# EAGLE design estimator_board (EAGLE 7.5.0)
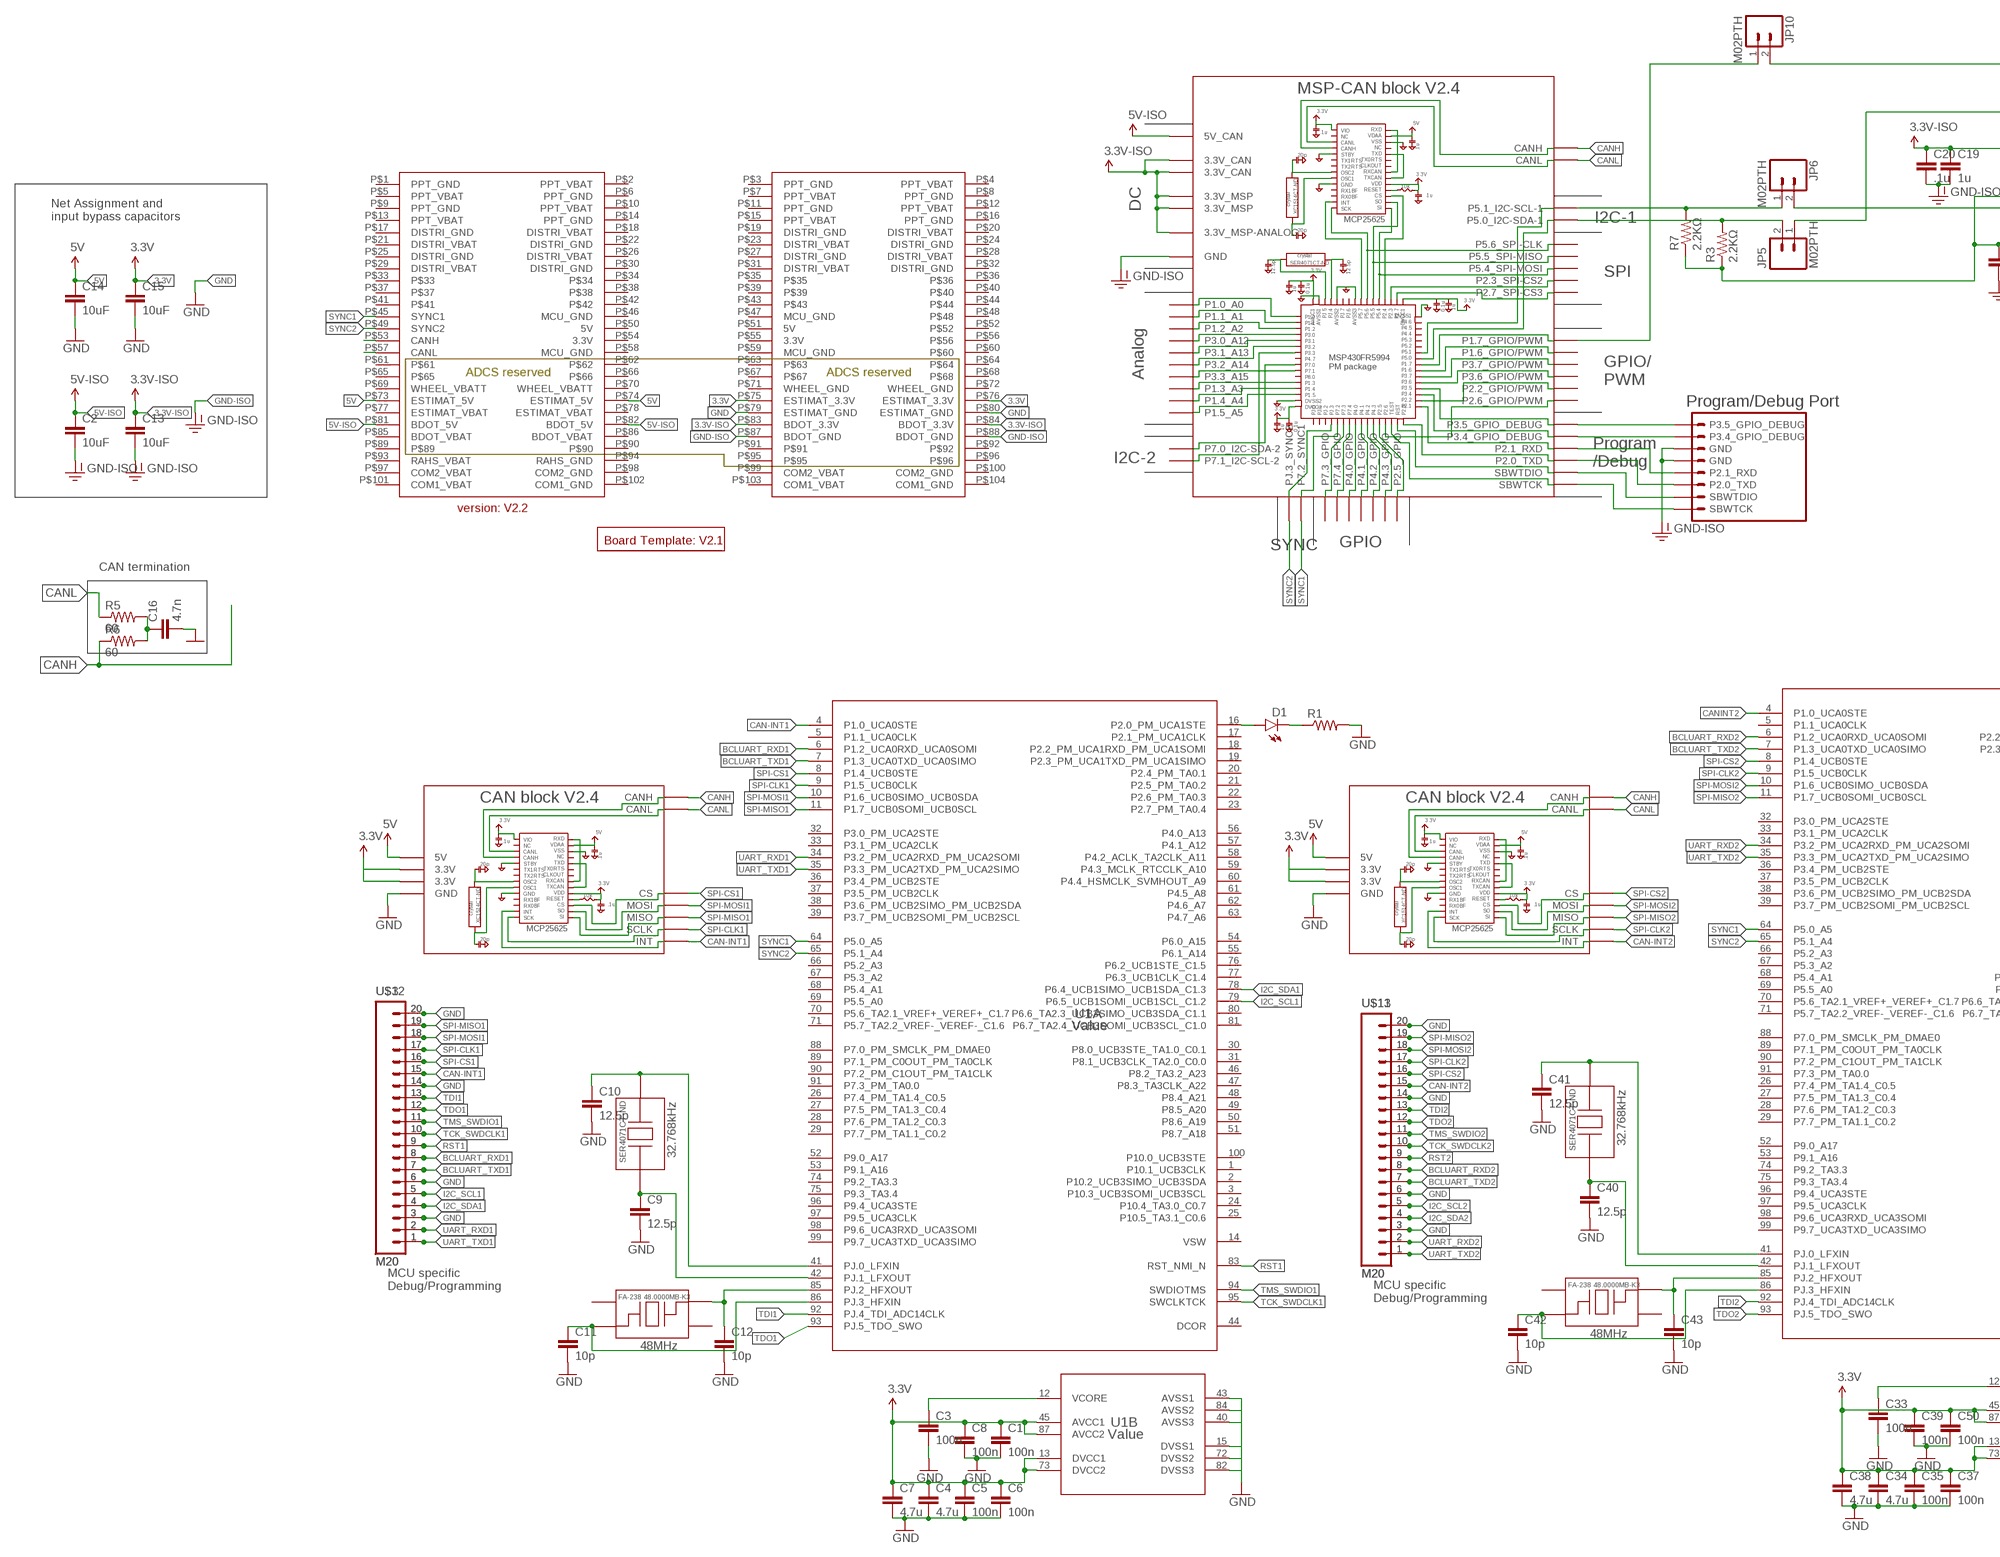
[diagram p0: schematic, sheet 1, part 1 of 2]
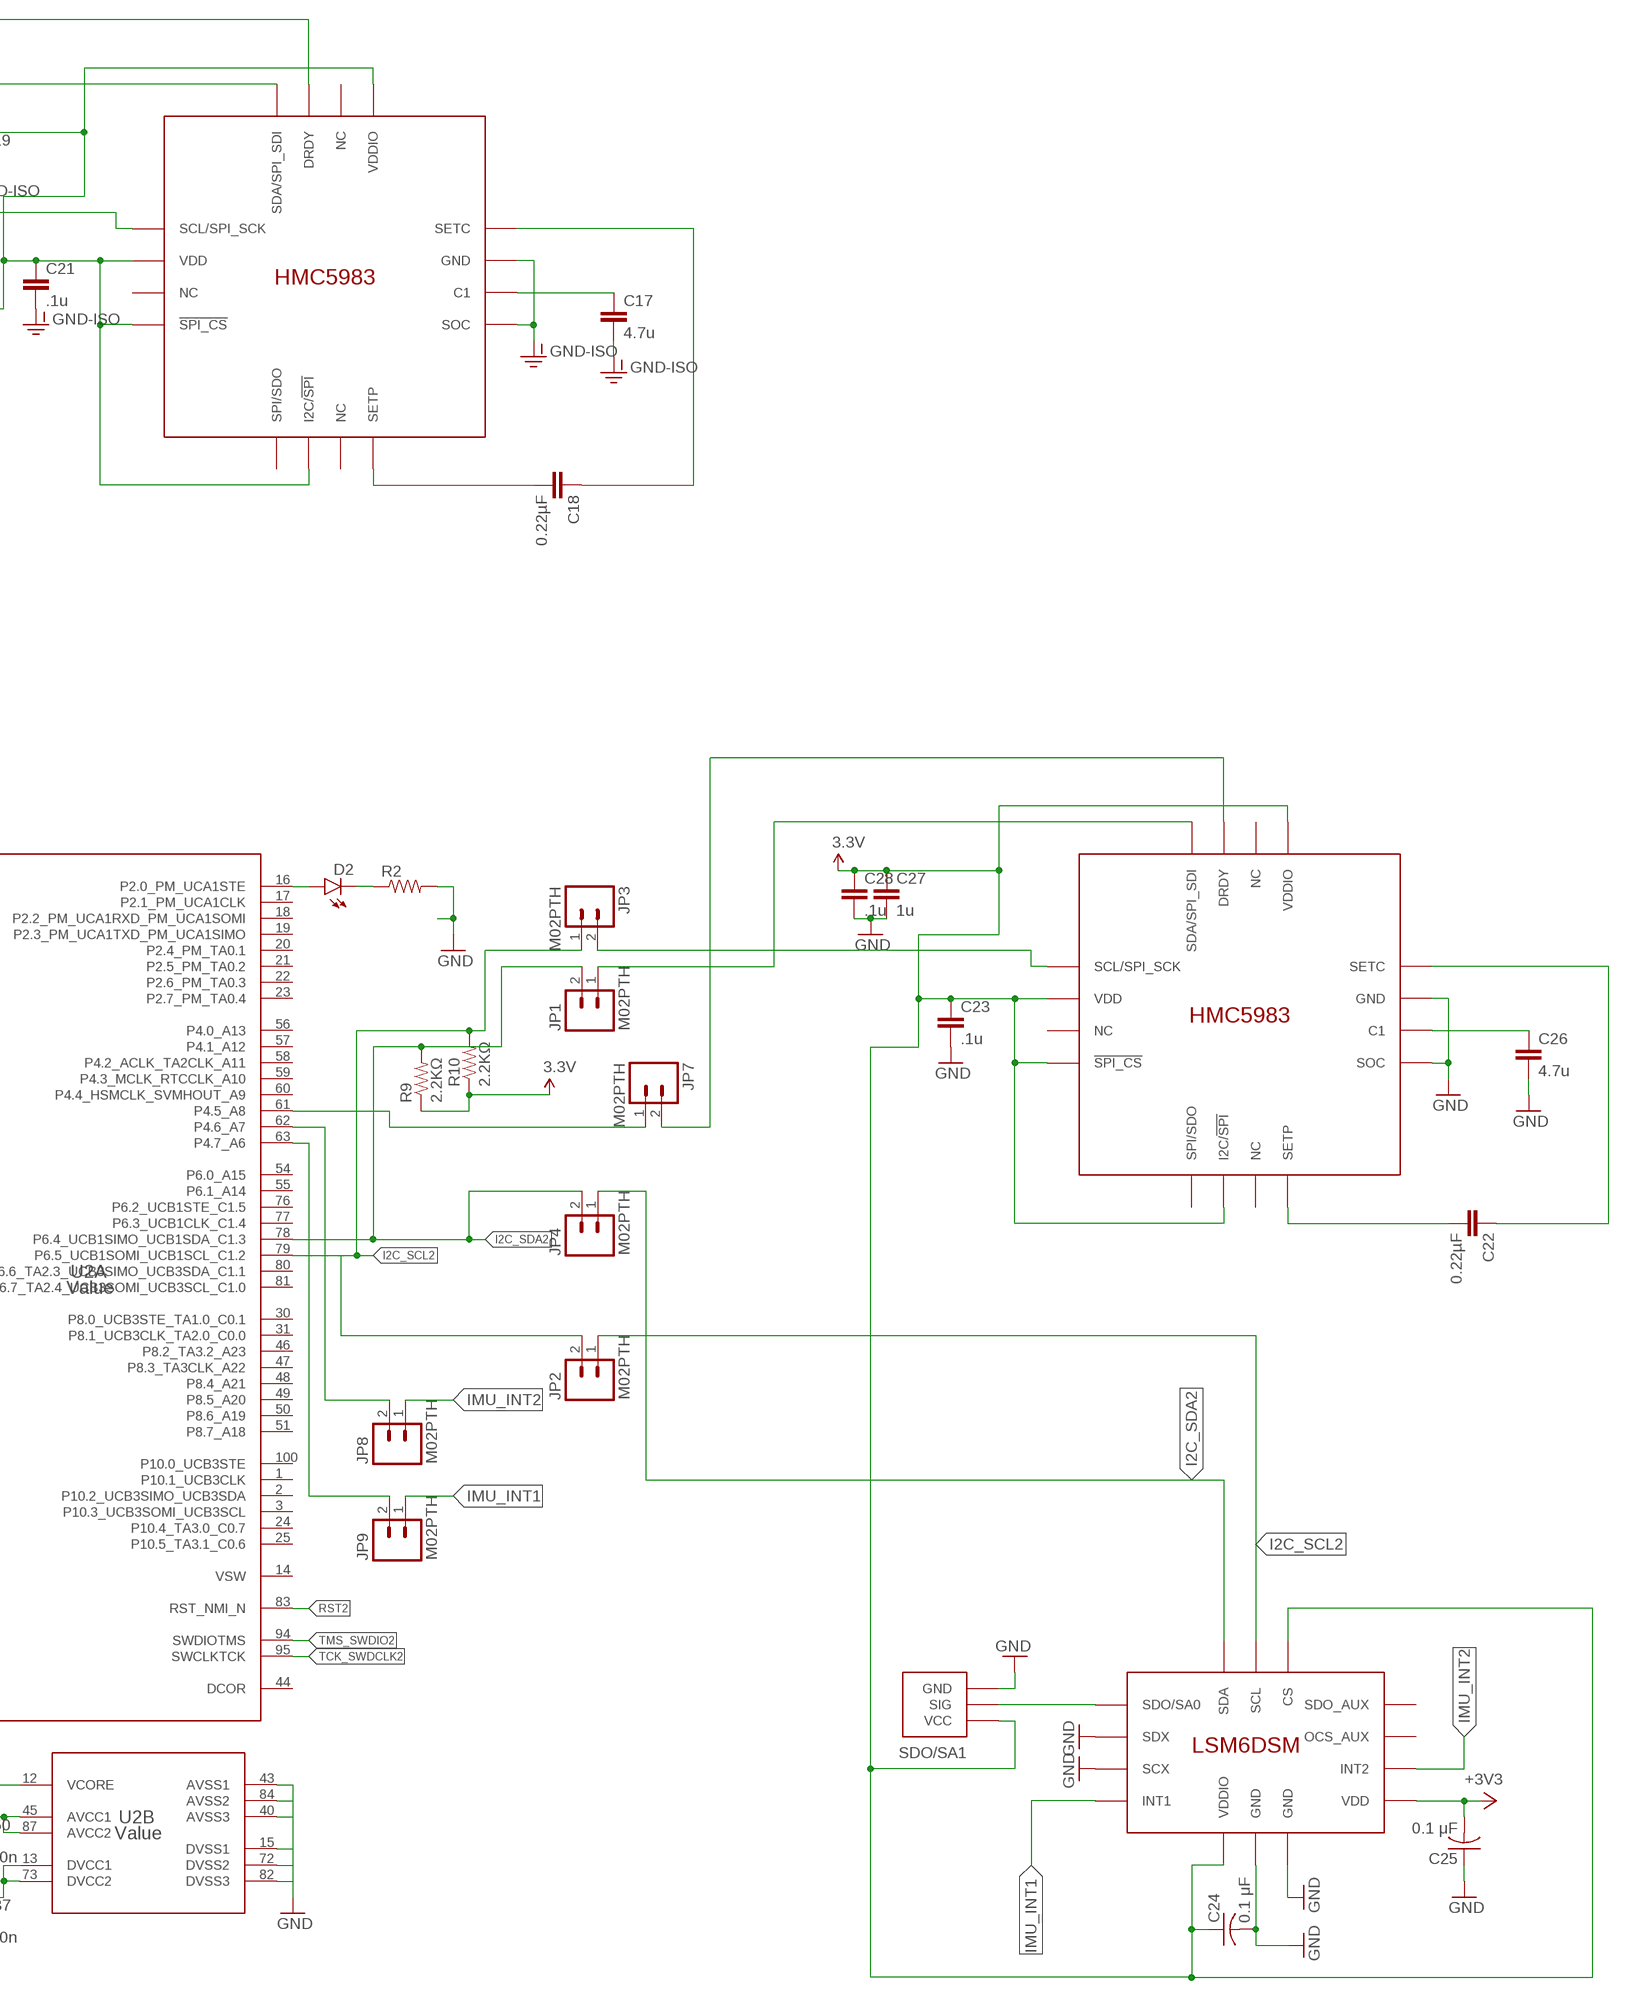
[diagram p1: schematic, sheet 1, part 2 of 2]

## Parts
C1  100n  CAPACITOR0805  [0805]
C2  10uF  CAPACITOR0805  [0805]
C3  100n  CAPACITOR0805  [0805]
C4  4.7u  CAPACITOR0805  [0805]
C5  100n  CAPACITOR0805  [0805]
C6  100n  CAPACITOR0805  [0805]
C7  4.7u  CAPACITOR0805  [0805]
C8  100n  CAPACITOR0805  [0805]
C9  12.5p  CAPACITOR0805  [0805]
C10  12.5p  CAPACITOR0805  [0805]
C11  10p  CAPACITOR0805  [0805]
C12  10p  CAPACITOR0805  [0805]
C13  10uF  CAPACITOR0805  [0805]
C14  10uF  CAPACITOR0805  [0805]
C15  10uF  CAPACITOR0805  [0805]
C16  4.7n  CAP0805  [0805]
C17  4.7u  CAPACITOR0805  [0805]
C18  0.22µF  CAPACITOR0805  [0805]
C19  1u  CAPACITOR0805  [0805]
C20  .1u  CAPACITOR0805  [0805]
C21  .1u  CAPACITOR0805  [0805]
C22  0.22µF  CAPACITOR0805  [0805]
C23  .1u  CAPACITOR0805  [0805]
C24  0.1 μF  C-USC0805  [C0805]
C25  0.1 μF  C-USC0805  [C0805]
C26  4.7u  CAPACITOR0805  [0805]
C27  1u  CAPACITOR0805  [0805]
C28  .1u  CAPACITOR0805  [0805]
C33  100n  CAPACITOR0805  [0805]
C34  4.7u  CAPACITOR0805  [0805]
C35  100n  CAPACITOR0805  [0805]
C37  100n  CAPACITOR0805  [0805]
C38  4.7u  CAPACITOR0805  [0805]
C39  100n  CAPACITOR0805  [0805]
C40  12.5p  CAPACITOR0805  [0805]
C41  12.5p  CAPACITOR0805  [0805]
C42  10p  CAPACITOR0805  [0805]
C43  10p  CAPACITOR0805  [0805]
C50  100n  CAPACITOR0805  [0805]
D1  LED  [LED-1206]
D2  LED  [LED-1206]
JP1  M02PTH  [1X02]
JP2  M02PTH  [1X02]
JP3  M02PTH  [1X02]
JP4  M02PTH  [1X02]
JP5  M02PTH  [1X02]
JP6  M02PTH  [1X02]
JP7  M02PTH  [1X02]
JP8  M02PTH  [1X02]
JP9  M02PTH  [1X02]
JP10  M02PTH  [1X02]
R1  RESISTOR0805  [0805]
R2  RESISTOR0805  [0805]
R3  2.2KΩ  RESISTOR0805  [0805]
R5  60  RESISTOR0805-RES  [0805]
R6  60  RESISTOR0805-RES  [0805]
R7  2.2KΩ  RESISTOR0805  [0805]
R9  2.2KΩ  RESISTOR0805  [0805]
R10  2.2KΩ  RESISTOR0805  [0805]
SDO/SA1  0_OHM_JUMPER  [0_OHM_JUMPER]
U1  Value  MSP432P401R_PZ  [PZ0100A_N]
U2  Value  MSP432P401R_PZ  [PZ0100A_N]
U$1  EPSON_CRYSTAL_FC-135R  [FC-135R]
U$2  EPSON_CRYSTAL_FA-238  [FA-238]
U$3  M20  [1X20]
U$4  EPSON_CRYSTAL_FC-135R  [FC-135R]
U$5  BOARD_TEMPLATE  [BOARD_TEMPLATE]
U$6  PC104_CONNECTOR  [PC104_CONNECTOR]
U$7  MSP-CAN_BLOCK  [MSP-CAN_BLOCK]
U$8  CAN_BLOCK  [CAN_BLOCK]
U$9  EPSON_CRYSTAL_FA-238  [FA-238]
U$10  CAN_BLOCK  [CAN_BLOCK]
U$11  M20  [1X20]
U$12  M20  [1X20]
U$13  M20  [1X20]
U$14  PROGRAM/DEBUG_PORT  [1X08_CONNECTOR]
U$15  HMC5983  [HMC5983]
U$17  LSM6DSM  [LSM6DSM]
U$18  HMC5983  [HMC5983]

## Nets
3.3V: C1.1 C4.1 C5.1 C6.1 C7.1 C8.1 C15.1 C23.1 C24.1 C25.2 C27.1 C28.1 C34.1 C35.1 C37.1 C38.1 C39.1 C50.1 R9.1 R10.1 SDO/SA1.P$3(VCC) U1.13(B:DVCC1) U1.45(B:AVCC1) U1.73(B:DVCC2) U1.87(B:AVCC2) U2.13(B:DVCC1) U2.45(B:AVCC1) U2.73(B:DVCC2) U2.87(B:AVCC2) U$6.P$75(ESTIMAT_3.3V) U$6.P$76(ESTIMAT_3.3V) U$8.3.3V@CAN1(3.3V) U$8.3.3V@CAN2(3.3V) U$10.3.3V@CAN1(3.3V) U$10.3.3V@CAN2(3.3V) U$17.CS U$17.VDD U$17.VDDIO U$18.!SPI_CS U$18.I2C/!SPI U$18.VDD U$18.VDDIO ; supply symbol labelled +3V3
3.3V-ISO: C13.1 C19.1 C20.1 C21.1 R3.1 R7.1 U$6.P$83(BDOT_3.3V) U$6.P$84(BDOT_3.3V) U$7.3.3V@CAN1(3.3V_CAN) U$7.3.3V@CAN2(3.3V_CAN) U$7.3.3V@MSP1(3.3V_MSP) U$7.3.3V@MSP2(3.3V_MSP) U$7.3.3V_ANALOG@MSP2(3.3V_MSP-ANALOG) U$15.!SPI_CS U$15.I2C/!SPI U$15.VDD U$15.VDDIO ; supply symbol labelled VCC
5V: C14.1 U$6.P$73(ESTIMAT_5V) U$6.P$74(ESTIMAT_5V) U$8.5V U$10.5V
5V-ISO: C2.1 U$6.P$81(BDOT_5V) U$6.P$82(BDOT_5V) U$7.5V(5V_CAN) ; supply symbol labelled VDD
BCLUART_RXD1: U1.6(A:P1.2_UCA0RXD_UCA0SOMI) U$3.8 U$12.8
BCLUART_RXD2: U2.6(A:P1.2_UCA0RXD_UCA0SOMI) U$11.8 U$13.8
BCLUART_TXD1: U1.7(A:P1.3_UCA0TXD_UCA0SIMO) U$3.7 U$12.7
BCLUART_TXD2: U2.7(A:P1.3_UCA0TXD_UCA0SIMO) U$11.7 U$13.7
CAN-INT1: U1.4(A:P1.0_UCA0STE) U$3.15 U$8.INT U$12.15
CAN-INT2: U$10.INT U$11.15 U$13.15
CANH: R6.1 U$6.P$53(CANH) U$7.CANH U$8.CANH U$10.CANH
CANINT2: U2.4(A:P1.0_UCA0STE)
CANL: R5.1 U$6.P$57(CANL) U$7.CANL U$8.CANL U$10.CANL
GND: C1.2 C3.2 C4.2 C5.2 C6.2 C7.2 C8.2 C9.2 C10.2 C11.2 C12.2 C14.2 C15.2 C16.2 C23.2 C24.2 C25.1 C26.2 C27.2 C28.2 C33.2 C34.2 C35.2 C37.2 C38.2 C39.2 C40.2 C41.2 C42.2 C43.2 C50.2 R1.2 R2.2 SDO/SA1.P$1(GND) U1.15(B:DVSS1) U1.40(B:AVSS3) U1.43(B:AVSS1) U1.72(B:DVSS2) U1.82(B:DVSS3) U1.84(B:AVSS2) U2.15(B:DVSS1) U2.40(B:AVSS3) U2.43(B:AVSS1) U2.72(B:DVSS2) U2.82(B:DVSS3) U2.84(B:AVSS2) U$3.3 U$3.6 U$3.14 U$3.20 U$6.P$79(ESTIMAT_GND) U$6.P$80(ESTIMAT_GND) U$8.GND@1(GND) U$8.GND@2(GND) U$8.GND@3(GND) U$8.GND@4(GND) U$8.GND@5(GND) U$8.GND@11(GND) U$8.GND@12(GND) U$8.GND@13(GND) U$10.GND@1(GND) U$10.GND@2(GND) U$10.GND@3(GND) U$10.GND@4(GND) U$10.GND@5(GND) U$10.GND@11(GND) U$10.GND@12(GND) U$10.GND@13(GND) U$11.3 U$11.6 U$11.14 U$11.20 U$12.3 U$12.6 U$12.14 U$12.20 U$13.3 U$13.6 U$13.14 U$13.20 U$17.GND@1(GND) U$17.GND@2(GND) U$17.SCX U$17.SDX U$18.GND U$18.SOC
GND-ISO: C2.2 C13.2 C17.2 C19.2 C20.2 C21.2 U$6.P$87(BDOT_GND) U$6.P$88(BDOT_GND) U$7.GND@1(GND) U$7.GND@2(GND) U$7.GND@3(GND) U$7.GND@4(GND) U$7.GND@5(GND) U$7.GND@7(GND) U$7.GND@8(GND) U$7.GND@9(GND) U$7.GND@10(GND) U$7.GND@11(GND) U$7.GND@12(GND) U$7.GND@13(GND) U$7.GND@14(GND) U$7.GND@15(GND) U$7.GND@16(GND) U$7.GND@17(GND) U$7.GND@26(GND) U$14.5(GND) U$14.6(GND) U$15.GND U$15.SOC
I2C_SCL1: U1.79(A:P6.5_UCB1SOMI_UCB1SCL_C1.2) U$3.5 U$12.5
I2C_SCL2: JP2.1 JP2.2 JP3.1 R10.2 U2.79(A:P6.5_UCB1SOMI_UCB1SCL_C1.2) U$11.5 U$13.5 U$17.SCL
I2C_SDA1: U1.78(A:P6.4_UCB1SIMO_UCB1SDA_C1.3) U$3.4 U$12.4
I2C_SDA2: JP1.1 JP1.2 JP4.1 JP4.2 R9.2 U2.78(A:P6.4_UCB1SIMO_UCB1SDA_C1.3) U$11.4 U$13.4 U$17.SDA U$18.SDA/SPI_SDI
IMU_INT1: JP9.1 U$17.INT1
IMU_INT2: JP8.1 U$17.INT2
N$1: D2.A U2.16(A:P2.0_PM_UCA1STE)
N$2: D2.C R2.1
N$3: D1.A U1.16(A:P2.0_PM_UCA1STE)
N$4: D1.C R1.1
N$5: U$7.P3.5_GPIO_DEBUG U$14.8(P3.5_GPIO_DEBUG)
N$6: U$7.P3.4_GPIO_DEBUG U$14.7(P3.4_GPIO_DEBUG)
N$7: C3.1 U1.12(B:VCORE)
N$8: C10.1 U1.41(A:PJ.0_LFXIN) U$1.P$2
N$9: C9.1 U1.42(A:PJ.1_LFXOUT) U$1.P$1
N$10: C12.1 U1.85(A:PJ.2_HFXOUT) U$2.P$3
N$11: C11.1 U1.86(A:PJ.3_HFXIN) U$2.P$1
N$12: U$7.P2.1_RXD U$14.4(P2.1_RXD)
N$13: U$7.P2.0_TXD U$14.3(P2.0_TXD)
N$14: U$7.SBWTDIO U$14.2(SBWTDIO)
N$15: U$7.SBWTCK U$14.SBWTCK
N$16: JP5.1 U$15.SDA/SPI_SDI
N$17: C16.1 R5.2 R6.2
N$18: JP6.2 U$15.SCL/SPI_SCK
N$19: C17.1 U$15.C1
N$20: C18.2 U$15.SETP
N$21: C18.1 U$15.SETC
N$22: JP10.2 U$15.DRDY
N$25: SDO/SA1.P$2(SIG) U$17.SDO/SA0
N$26: JP3.2 U$18.SCL/SPI_SCK
N$27: JP6.1 R7.2 U$7.P5.1_I2C-SCL-1
N$28: JP5.2 R3.2 U$7.P5.0_I2C-SDA-1
N$29: JP8.2 U2.62(A:P4.6_A7)
N$30: JP7.1 U2.61(A:P4.5_A8)
N$31: JP10.1 U$7.P1.7_GPIO/PWM
N$32: JP9.2 U2.63(A:P4.7_A6)
N$34: C26.1 U$18.C1
N$35: C22.2 U$18.SETP
N$36: C22.1 U$18.SETC
N$38: JP7.2 U$18.DRDY
N$40: C40.1 U2.42(A:PJ.1_LFXOUT) U$4.P$1
N$41: C41.1 U2.41(A:PJ.0_LFXIN) U$4.P$2
N$42: C42.1 U2.86(A:PJ.3_HFXIN) U$9.P$1
N$43: C43.1 U2.85(A:PJ.2_HFXOUT) U$9.P$3
RST1: U1.83(A:RST_NMI_N) U$3.9 U$12.9
RST2: U2.83(A:RST_NMI_N) U$11.9 U$13.9
SPI-CLK1: U1.9(A:P1.5_UCB0CLK) U$3.17 U$8.CLK(SCLK) U$12.17
SPI-CLK2: U2.9(A:P1.5_UCB0CLK) U$10.CLK(SCLK) U$11.17 U$13.17
SPI-CS1: U1.8(A:P1.4_UCB0STE) U$3.16 U$8.CS U$12.16
SPI-CS2: U2.8(A:P1.4_UCB0STE) U$10.CS U$11.16 U$13.16
SPI-MISO1: U1.11(A:P1.7_UCB0SOMI_UCB0SCL) U$3.19 U$8.MISO U$12.19
SPI-MISO2: U2.11(A:P1.7_UCB0SOMI_UCB0SCL) U$10.MISO U$11.19 U$13.19
SPI-MOSI1: U1.10(A:P1.6_UCB0SIMO_UCB0SDA) U$3.18 U$8.MOSI U$12.18
SPI-MOSI2: U2.10(A:P1.6_UCB0SIMO_UCB0SDA) U$10.MOSI U$11.18 U$13.18
SYNC1: U1.64(A:P5.0_A5) U2.64(A:P5.0_A5) U$6.P$45(SYNC1) U$7.P7.2_SYNC1
SYNC2: U1.65(A:P5.1_A4) U2.65(A:P5.1_A4) U$6.P$49(SYNC2) U$7.PJ.3_SYNC2
TCK_SWDCLK1: U1.95(A:SWCLKTCK) U$3.10 U$12.10
TCK_SWDCLK2: U2.95(A:SWCLKTCK) U$11.10 U$13.10
TDI1: U1.92(A:PJ.4_TDI_ADC14CLK) U$3.13 U$12.13
TDI2: U2.92(A:PJ.4_TDI_ADC14CLK) U$11.13 U$13.13
TDO1: U1.93(A:PJ.5_TDO_SWO) U$3.12 U$12.12
TDO2: U2.93(A:PJ.5_TDO_SWO) U$11.12 U$13.12
TMS_SWDIO1: U1.94(A:SWDIOTMS) U$3.11 U$12.11
TMS_SWDIO2: U2.94(A:SWDIOTMS) U$11.11 U$13.11
UART_RXD1: U1.34(A:P3.2_PM_UCA2RXD_PM_UCA2SOMI) U$3.2 U$12.2
UART_RXD2: U2.34(A:P3.2_PM_UCA2RXD_PM_UCA2SOMI) U$11.2 U$13.2
UART_TXD1: U1.35(A:P3.3_PM_UCA2TXD_PM_UCA2SIMO) U$3.1 U$12.1
UART_TXD2: U2.35(A:P3.3_PM_UCA2TXD_PM_UCA2SIMO) U$11.1 U$13.1
VCORE: C33.1 U2.12(B:VCORE)
Unconnected: U1.1(A:P10.1_UCB3CLK) U1.2(A:P10.2_UCB3SIMO_UCB3SDA) U1.3(A:P10.3_UCB3SOMI_UCB3SCL) U1.5(A:P1.1_UCA0CLK) U1.14(A:VSW) U1.17(A:P2.1_PM_UCA1CLK) U1.18(A:P2.2_PM_UCA1RXD_PM_UCA1SOMI) U1.19(A:P2.3_PM_UCA1TXD_PM_UCA1SIMO) U1.20(A:P2.4_PM_TA0.1) U1.21(A:P2.5_PM_TA0.2) U1.22(A:P2.6_PM_TA0.3) U1.23(A:P2.7_PM_TA0.4) U1.24(A:P10.4_TA3.0_C0.7) U1.25(A:P10.5_TA3.1_C0.6) U1.26(A:P7.4_PM_TA1.4_C0.5) U1.27(A:P7.5_PM_TA1.3_C0.4) U1.28(A:P7.6_PM_TA1.2_C0.3) U1.29(A:P7.7_PM_TA1.1_C0.2) U1.30(A:P8.0_UCB3STE_TA1.0_C0.1) U1.31(A:P8.1_UCB3CLK_TA2.0_C0.0) U1.32(A:P3.0_PM_UCA2STE) U1.33(A:P3.1_PM_UCA2CLK) U1.36(A:P3.4_PM_UCB2STE) U1.37(A:P3.5_PM_UCB2CLK) U1.38(A:P3.6_PM_UCB2SIMO_PM_UCB2SDA) U1.39(A:P3.7_PM_UCB2SOMI_PM_UCB2SCL) U1.44(A:DCOR) U1.46(A:P8.2_TA3.2_A23) U1.47(A:P8.3_TA3CLK_A22) U1.48(A:P8.4_A21) U1.49(A:P8.5_A20) U1.50(A:P8.6_A19) U1.51(A:P8.7_A18) U1.52(A:P9.0_A17) U1.53(A:P9.1_A16) U1.54(A:P6.0_A15) U1.55(A:P6.1_A14) U1.56(A:P4.0_A13) U1.57(A:P4.1_A12) U1.58(A:P4.2_ACLK_TA2CLK_A11) U1.59(A:P4.3_MCLK_RTCCLK_A10) U1.60(A:P4.4_HSMCLK_SVMHOUT_A9) U1.61(A:P4.5_A8) U1.62(A:P4.6_A7) U1.63(A:P4.7_A6) U1.66(A:P5.2_A3) U1.67(A:P5.3_A2) U1.68(A:P5.4_A1) U1.69(A:P5.5_A0) U1.70(A:P5.6_TA2.1_VREF+_VEREF+_C1.7) U1.71(A:P5.7_TA2.2_VREF-_VEREF-_C1.6) U1.74(A:P9.2_TA3.3) U1.75(A:P9.3_TA3.4) U1.76(A:P6.2_UCB1STE_C1.5) U1.77(A:P6.3_UCB1CLK_C1.4) U1.80(A:P6.6_TA2.3_UCB3SIMO_UCB3SDA_C1.1) U1.81(A:P6.7_TA2.4_UCB3SOMI_UCB3SCL_C1.0) U1.88(A:P7.0_PM_SMCLK_PM_DMAE0) U1.89(A:P7.1_PM_C0OUT_PM_TA0CLK) U1.90(A:P7.2_PM_C1OUT_PM_TA1CLK) U1.91(A:P7.3_PM_TA0.0) U1.96(A:P9.4_UCA3STE) U1.97(A:P9.5_UCA3CLK) U1.98(A:P9.6_UCA3RXD_UCA3SOMI) U1.99(A:P9.7_UCA3TXD_UCA3SIMO) U1.100(A:P10.0_UCB3STE) U2.1(A:P10.1_UCB3CLK) U2.2(A:P10.2_UCB3SIMO_UCB3SDA) U2.3(A:P10.3_UCB3SOMI_UCB3SCL) U2.5(A:P1.1_UCA0CLK) U2.14(A:VSW) U2.17(A:P2.1_PM_UCA1CLK) U2.18(A:P2.2_PM_UCA1RXD_PM_UCA1SOMI) U2.19(A:P2.3_PM_UCA1TXD_PM_UCA1SIMO) U2.20(A:P2.4_PM_TA0.1) U2.21(A:P2.5_PM_TA0.2) U2.22(A:P2.6_PM_TA0.3) U2.23(A:P2.7_PM_TA0.4) U2.24(A:P10.4_TA3.0_C0.7) U2.25(A:P10.5_TA3.1_C0.6) U2.26(A:P7.4_PM_TA1.4_C0.5) U2.27(A:P7.5_PM_TA1.3_C0.4) U2.28(A:P7.6_PM_TA1.2_C0.3) U2.29(A:P7.7_PM_TA1.1_C0.2) U2.30(A:P8.0_UCB3STE_TA1.0_C0.1) U2.31(A:P8.1_UCB3CLK_TA2.0_C0.0) U2.32(A:P3.0_PM_UCA2STE) U2.33(A:P3.1_PM_UCA2CLK) U2.36(A:P3.4_PM_UCB2STE) U2.37(A:P3.5_PM_UCB2CLK) U2.38(A:P3.6_PM_UCB2SIMO_PM_UCB2SDA) U2.39(A:P3.7_PM_UCB2SOMI_PM_UCB2SCL) U2.44(A:DCOR) U2.46(A:P8.2_TA3.2_A23) U2.47(A:P8.3_TA3CLK_A22) U2.48(A:P8.4_A21) U2.49(A:P8.5_A20) U2.50(A:P8.6_A19) U2.51(A:P8.7_A18) U2.52(A:P9.0_A17) U2.53(A:P9.1_A16) U2.54(A:P6.0_A15) U2.55(A:P6.1_A14) U2.56(A:P4.0_A13) U2.57(A:P4.1_A12) U2.58(A:P4.2_ACLK_TA2CLK_A11) U2.59(A:P4.3_MCLK_RTCCLK_A10) U2.60(A:P4.4_HSMCLK_SVMHOUT_A9) U2.66(A:P5.2_A3) U2.67(A:P5.3_A2) U2.68(A:P5.4_A1) U2.69(A:P5.5_A0) U2.70(A:P5.6_TA2.1_VREF+_VEREF+_C1.7) U2.71(A:P5.7_TA2.2_VREF-_VEREF-_C1.6) U2.74(A:P9.2_TA3.3) U2.75(A:P9.3_TA3.4) U2.76(A:P6.2_UCB1STE_C1.5) U2.77(A:P6.3_UCB1CLK_C1.4) U2.80(A:P6.6_TA2.3_UCB3SIMO_UCB3SDA_C1.1) U2.81(A:P6.7_TA2.4_UCB3SOMI_UCB3SCL_C1.0) U2.88(A:P7.0_PM_SMCLK_PM_DMAE0) U2.89(A:P7.1_PM_C0OUT_PM_TA0CLK) U2.90(A:P7.2_PM_C1OUT_PM_TA1CLK) U2.91(A:P7.3_PM_TA0.0) U2.96(A:P9.4_UCA3STE) U2.97(A:P9.5_UCA3CLK) U2.98(A:P9.6_UCA3RXD_UCA3SOMI) U2.99(A:P9.7_UCA3TXD_UCA3SIMO) U2.100(A:P10.0_UCB3STE) U$2.P$2 U$2.P$4 U$6.P$1(PPT_GND) U$6.P$2(PPT_VBAT) U$6.P$3(PPT_GND) U$6.P$4(PPT_VBAT) U$6.P$5(PPT_VBAT) U$6.P$6(PPT_GND) U$6.P$7(PPT_VBAT) U$6.P$8(PPT_GND) U$6.P$9(PPT_GND) U$6.P$10(PPT_VBAT) U$6.P$11(PPT_GND) U$6.P$12(PPT_VBAT) U$6.P$13(PPT_VBAT) U$6.P$14(PPT_GND) U$6.P$15(PPT_VBAT) U$6.P$16(PPT_GND) U$6.P$17(DISTRI_GND) U$6.P$18(DISTRI_VBAT) U$6.P$19(DISTRI_GND) U$6.P$20(DISTRI_VBAT) U$6.P$21(DISTRI_VBAT) U$6.P$22(DISTRI_GND) U$6.P$23(DISTRI_VBAT) U$6.P$24(DISTRI_GND) U$6.P$25(DISTRI_GND) U$6.P$26(DISTRI_VBAT) U$6.P$27(DISTRI_GND) U$6.P$28(DISTRI_VBAT) U$6.P$29(DISTRI_VBAT) U$6.P$30(DISTRI_GND) U$6.P$31(DISTRI_VBAT) U$6.P$32(DISTRI_GND) U$6.P$33 U$6.P$34 U$6.P$35 U$6.P$36 U$6.P$37 U$6.P$38 U$6.P$39 U$6.P$40 U$6.P$41 U$6.P$42 U$6.P$43 U$6.P$44 U$6.P$46(MCU_GND) U$6.P$47(MCU_GND) U$6.P$48 U$6.P$50(5V) U$6.P$51(5V) U$6.P$52 U$6.P$54(3.3V) U$6.P$55(3.3V) U$6.P$56 U$6.P$58(MCU_GND) U$6.P$59(MCU_GND) U$6.P$60 U$6.P$61 U$6.P$62 U$6.P$63 U$6.P$64 U$6.P$65 U$6.P$66 U$6.P$67 U$6.P$68 U$6.P$69(WHEEL_VBATT) U$6.P$70(WHEEL_VBATT) U$6.P$71(WHEEL_GND) U$6.P$72(WHEEL_GND) U$6.P$77(ESTIMAT_VBAT) U$6.P$78(ESTIMAT_VBAT) U$6.P$85(BDOT_VBAT) U$6.P$86(BDOT_VBAT) U$6.P$89 U$6.P$90 U$6.P$91 U$6.P$92 U$6.P$93(RAHS_VBAT) U$6.P$94(RAHS_GND) U$6.P$95 U$6.P$96 U$6.P$97(COM2_VBAT) U$6.P$98(COM2_GND) U$6.P$99(COM2_VBAT) U$6.P$100(COM2_GND) U$6.P$101(COM1_VBAT) U$6.P$102(COM1_GND) U$6.P$103(COM1_VBAT) U$6.P$104(COM1_GND) U$7.P1.0_A0 U$7.P1.1_A1 U$7.P1.2_A2 U$7.P1.3_A3 U$7.P1.4_A4 U$7.P1.5_A5 U$7.P1.6_GPIO/PWM U$7.P2.2_GPIO/PWM U$7.P2.4_SPI-CS2(P2.3_SPI-CS2) U$7.P2.5_GPIO U$7.P2.6_GPIO/PWM U$7.P2.7_SPI-CS3 U$7.P3.0_A12 U$7.P3.1_A13 U$7.P3.2_A14 U$7.P3.3_A15 U$7.P3.6_GPIO/PWM U$7.P3.7_GPIO/PWM U$7.P4.0_GPIO U$7.P4.1_GPIO U$7.P4.2_GPIO U$7.P4.3_GPIO U$7.P5.4_SPI-MOSI U$7.P5.5_SPI-MISO U$7.P5.6_SPI-CLK U$7.P7.0_I2C-SDA-2 U$7.P7.1_I2C-SCL-2 U$7.P7.3_GPIO U$7.P7.4_GPIO U$9.P$2 U$9.P$4 U$15.NC@1(NC) U$15.NC@2(NC) U$15.NC@3(NC) U$15.SPI_SDO(SPI/SDO) U$17.OCS_AUX U$17.SDO_AUX U$18.NC@1(NC) U$18.NC@2(NC) U$18.NC@3(NC) U$18.SPI_SDO(SPI/SDO)

## Notes on the sheet
- Net Assignment and 
  input bypass capacitors
- CAN termination
- MCU specific 
  Debug/Programming
- MCU specific 
  Debug/Programming

## Library data of the parts
C1-C15 C17-C23 C26-C28 C33-C35 C37-C43 C50 = DubSat1 Components:CAPACITOR: Capacitor Standard 0603 ceramic capacitor, and 0.1" leaded capacitor.
C16 = SparkFun-Capacitors:CAP: Capacitor Standard 0603 ceramic capacitor, and 0.1" leaded capacitor.
C24 C25 = rcl:C-US: CAPACITOR, American symbol
D1 D2 = DubSat1 Components:LED
JP1-JP10 = SparkFun-Connectors:M02: Standard 2-pin 0.1" header. Use with - straight break away headers ( PRT-00116) - right angle break away headers (PRT-00553) - swiss pins (PRT-00743) - machine pins (PRT-00117) - female headers (PRT-00115) Molex polarized connector foot print use with: PRT-08233 with associated crimp pins and housings. 2.54_SCREWTERM for use with PRT-10571. 3.5mm Screw Terminal footprints for PRT-08084 5mm Screw Terminal footprints for use with PRT-08432
R1-R3 R7 R9 R10 = DubSat1 Components:RESISTOR: Resistor Basic schematic elements and footprints for 0603, 1206, and PTH resistors.
R5 R6 = SparkFun-Resistors:RESISTOR: Resistor Basic schematic elements and footprints for 0603, 1206, and PTH resistors.
SDO/SA1 = DubSat1 Components:0_OHM_JUMPER
U1 U2 = DubSat1 Components:MSP432P401R_PZ; COMPTYPE: IC; MANUFACTURER: Texas Instruments; MOUNTTYPE: SMT; PACKAGEREFERENCE: PZ0100A; PARTNUMBER: XMS432P401RIPZR; PIN_COUNT: 100; REFDES: RefDes; TYPE: TYPE
U$1 U$4 = DubSat1 Components:EPSON_CRYSTAL_FC-135R
U$2 U$9 = DubSat1 Components:EPSON_CRYSTAL_FA-238
U$3 U$11-U$13 = SparkFun-Connectors:M20: 1x20 .1" header This is just like the LOCK variant in that the holes are staggared by 5 mil, but except for the last two holes. They are not altered from the "standard" footprint layout. This is used for a special purpose on the layout of our Graphic LCD Backpack. Make sure you want to use this device before selecting it for you project!
U$5 = DubSat1 Components:BOARD_TEMPLATE
U$6 = DubSat1 Components:PC104_CONNECTOR
U$7 = DubSat1 Components:MSP-CAN_BLOCK
U$8 U$10 = DubSat1 Components:CAN_BLOCK
U$14 = DubSat1 Components:PROGRAM/DEBUG_PORT
U$15 U$18 = DubSat1 Components:HMC5983
U$17 = LSM6DSM:LSM6DSM

## Board
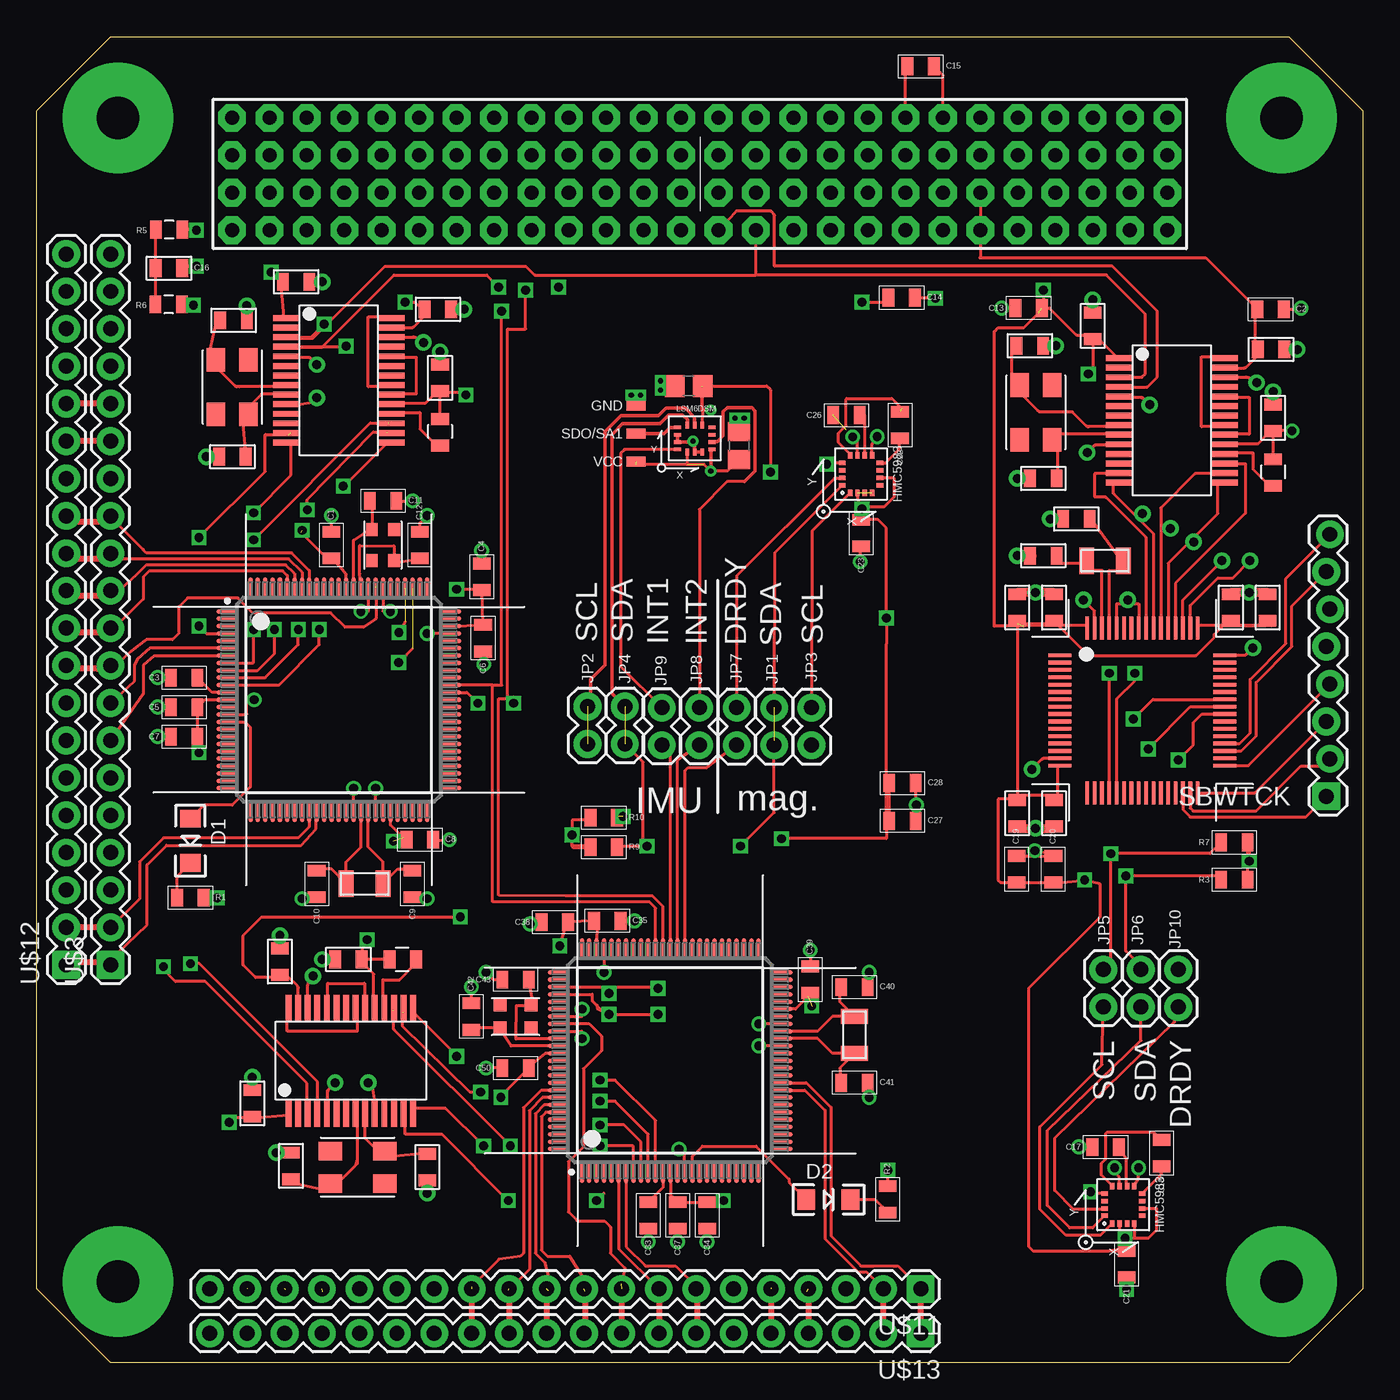
[diagram p2: board, top side]
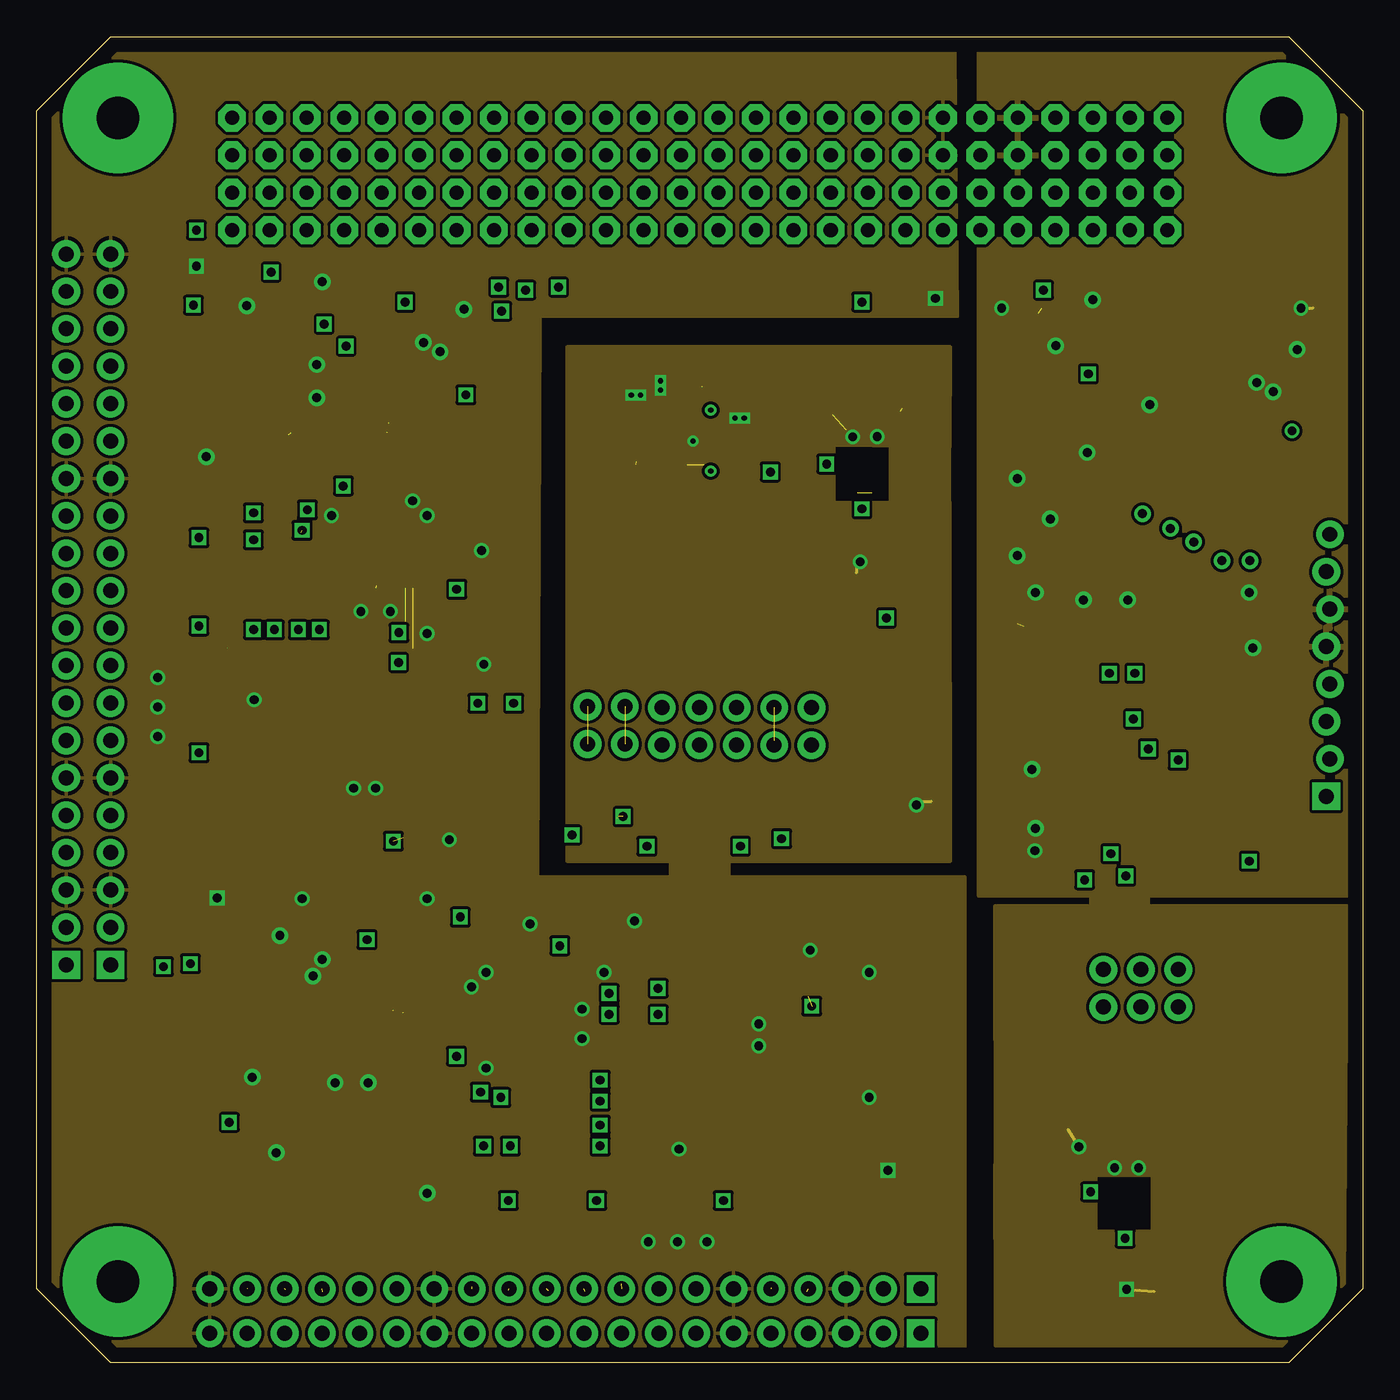
[diagram p3: board, inner layer GND]
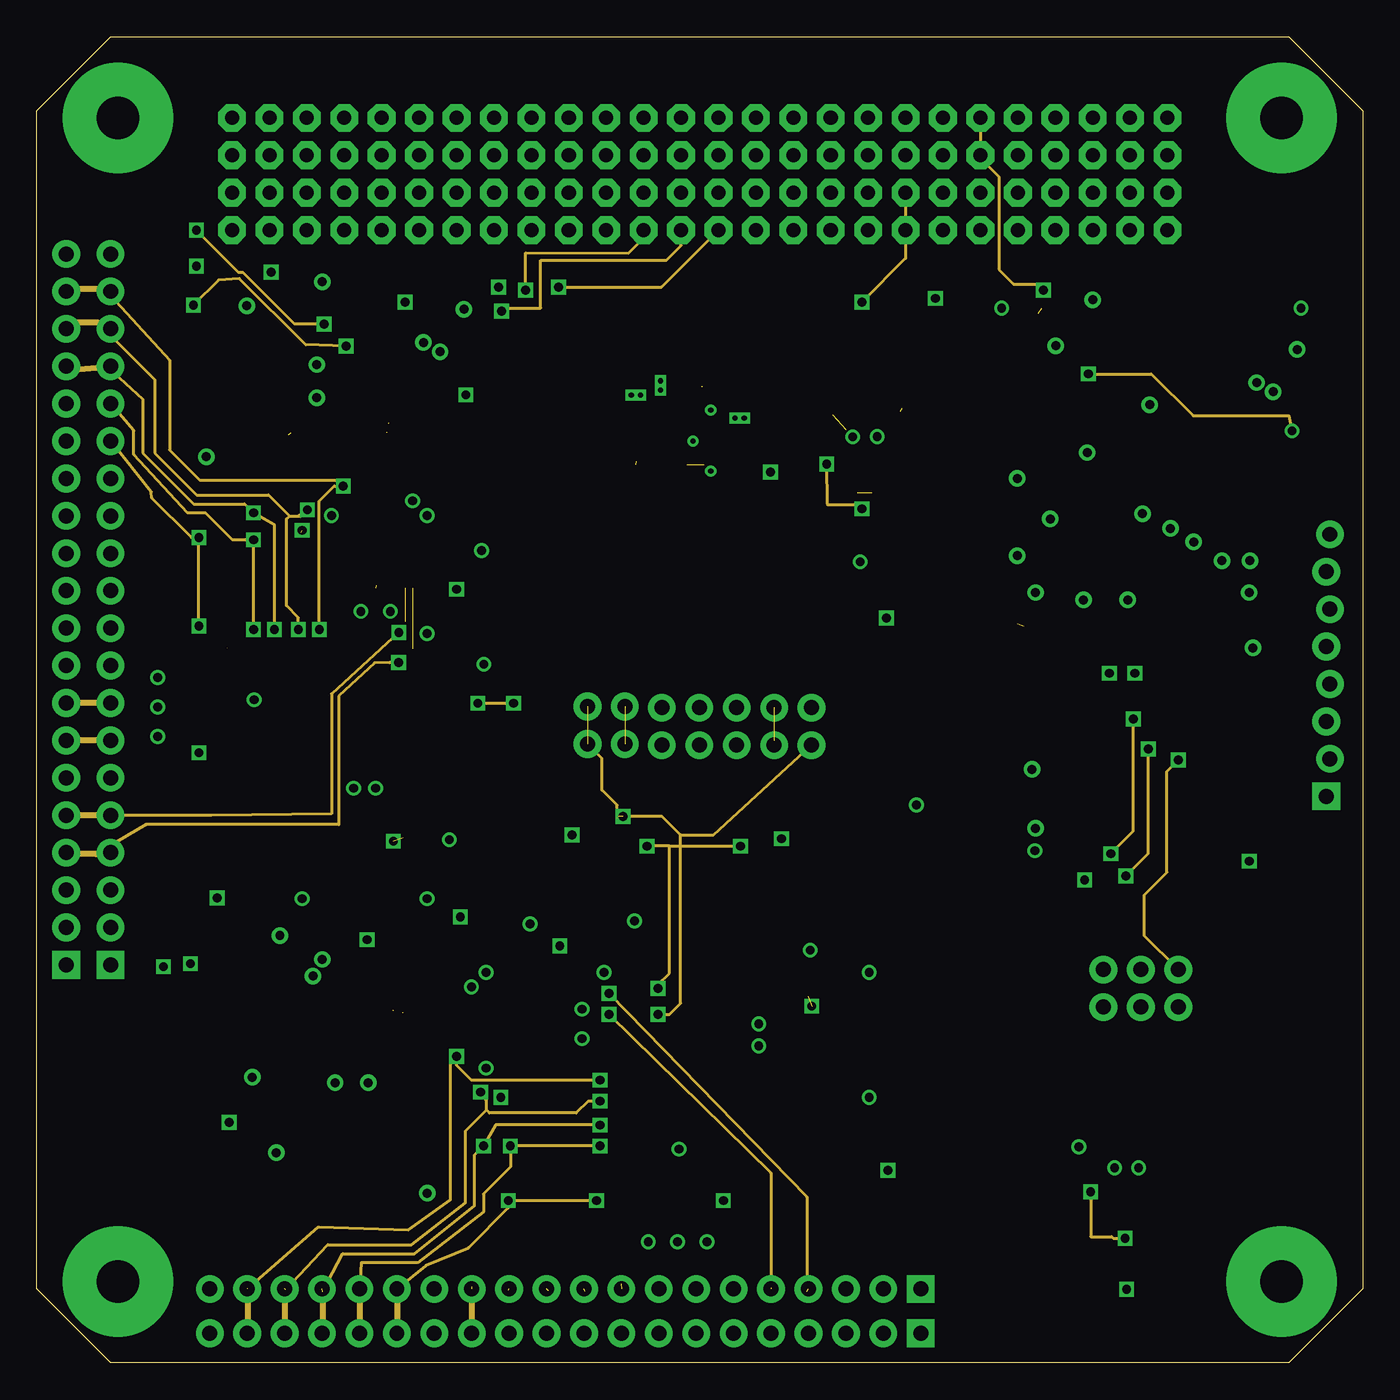
[diagram p4: board, inner layer Route3]
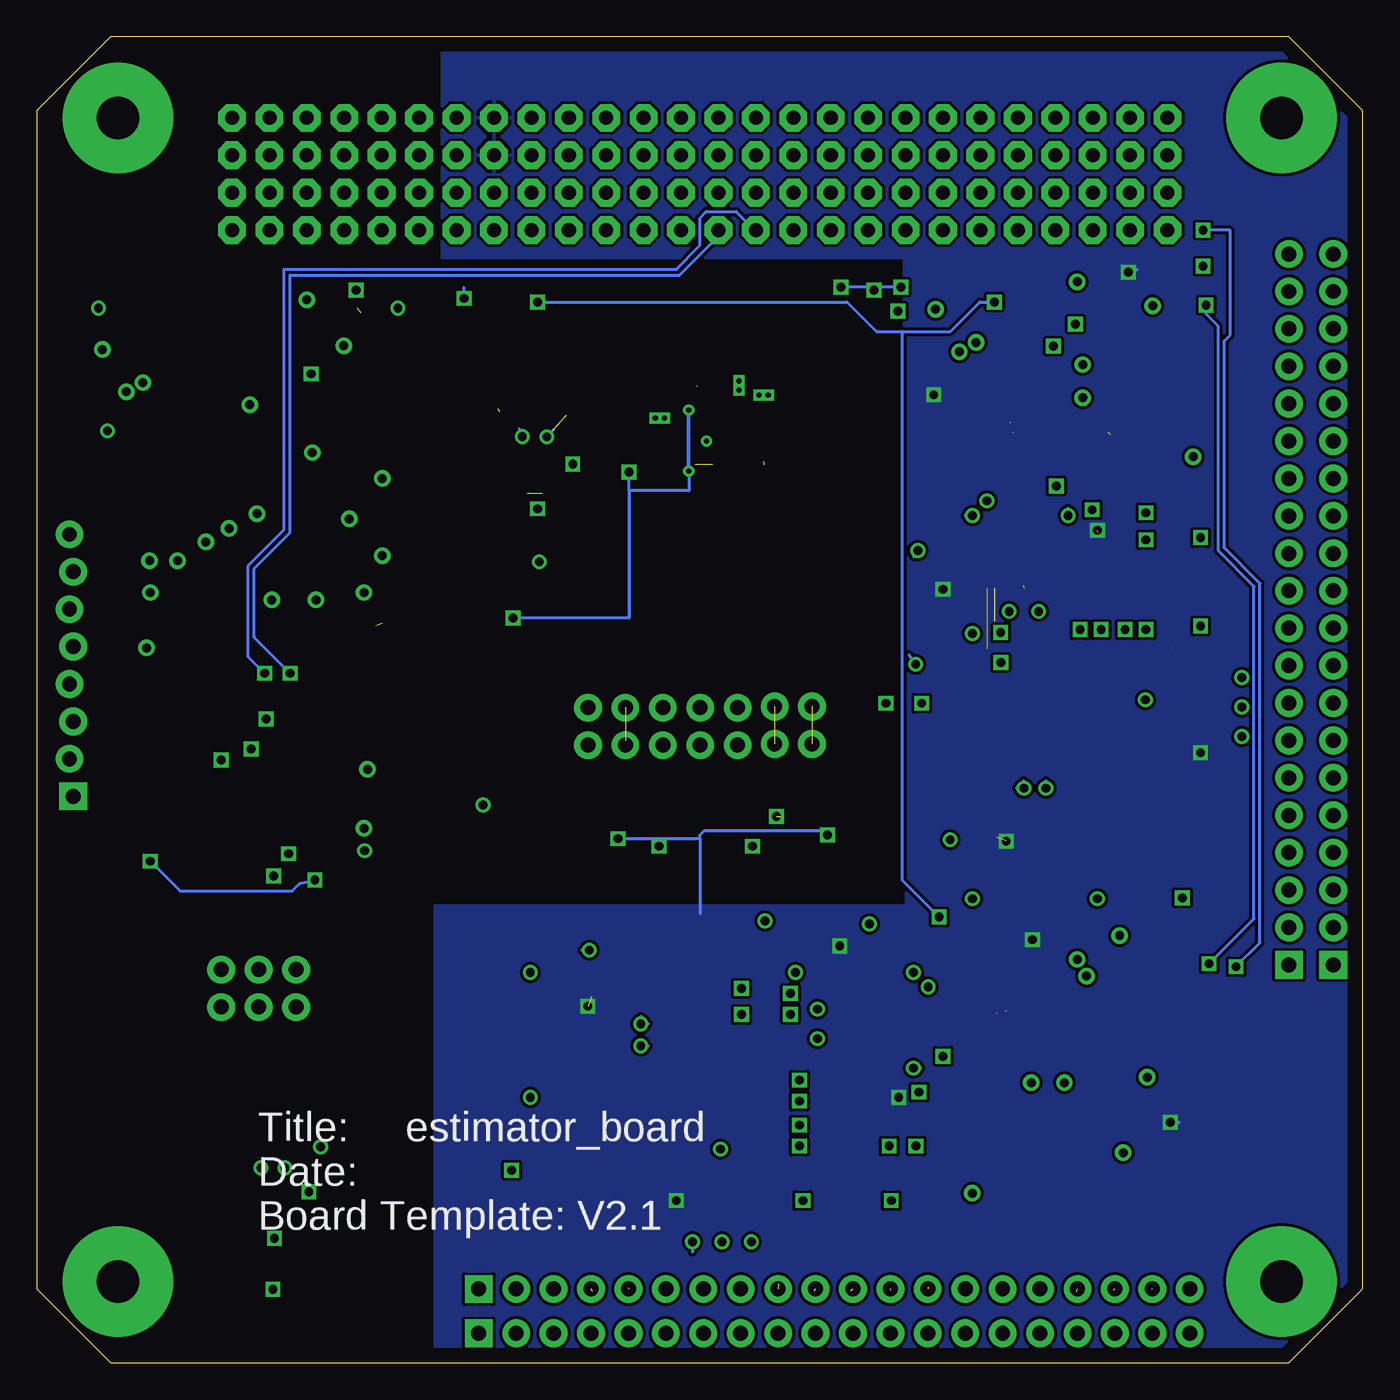
[diagram p5: board, bottom side, seen from below]

Size 90 x 90 mm. Coordinates in mm from the lower left corner, seen from the top.
Copper layers (1*2*3*16): Top 0.035mm / dielectric 1.5mm / GND 0.035mm / dielectric 0.15mm / Route3 0.035mm / dielectric 0.2mm / Bottom 0.035mm
Design rules "default *": minimum track width 10mil, minimum drill 24mil, track to track 8mil, track to pad 8mil, pad to pad 8mil, via to via 8mil, smd to smd 8mil, copper to edge 40mil, drill to drill 8mil, minimum pad ring 10mil, minimum via ring 8mil, stop-mask expansion 4mil, vias tented up to drill 0mil, thermal gap 10mil

### Footprints (pad centres in the part's own frame; a part is rotated, then mirrored left to right if it is on the bottom)
0805 = smd 0.8 x 1.2: 1 -0.9,0; 2 0.9,0
C0805 = smd 1.3 x 1.5: 1 -0.95,0; 2 0.95,0
LED-1206 = smd 1.2 x 1.4: A -1.5,0; C 1.5,0
1X02 = drill 1.016 pad 1.88: 1 0,0; 2 2.54,0
0_OHM_JUMPER = smd 1.3 x 0.7: P$1 0,-1.9; P$2 0,0; P$3 0,1.9
PZ0100A_N = smd 1.45 x 0.3: 1 -7.575,6; 2 -7.575,5.5; 3 -7.575,5; 4 -7.575,4.5; 5 -7.575,4; 6 -7.575,3.5; 7 -7.575,3; 8 -7.575,2.5; 9 -7.575,2; 10 -7.575,1.5; 11 -7.575,1; 12 -7.575,0.5; 13 -7.575,0; 14 -7.575,-0.5; 15 -7.575,-1; 16 -7.575,-1.5; 17 -7.575,-2; 18 -7.575,-2.5; 19 -7.575,-3; 20 -7.575,-3.5; 21 -7.575,-4; 22 -7.575,-4.5; 23 -7.575,-5; 24 -7.575,-5.5; 25 -7.575,-6; 51 7.575,-6; 52 7.575,-5.5; 53 7.575,-5; 54 7.575,-4.5; 55 7.575,-4; 56 7.575,-3.5; 57 7.575,-3; 58 7.575,-2.5; 59 7.575,-2; 60 7.575,-1.5; 61 7.575,-1; 62 7.575,-0.5; 63 7.575,0; 64 7.575,0.5; 65 7.575,1; 66 7.575,1.5; 67 7.575,2; 68 7.575,2.5; 69 7.575,3; 70 7.575,3.5; 71 7.575,4; 72 7.575,4.5; 73 7.575,5; 74 7.575,5.5; 75 7.575,6 | smd 0.3 x 1.45: 26 -6,-7.575; 27 -5.5,-7.575; 28 -5,-7.575; 29 -4.5,-7.575; 30 -4,-7.575; 31 -3.5,-7.575; 32 -3,-7.575; 33 -2.5,-7.575; 34 -2,-7.575; 35 -1.5,-7.575; 36 -1,-7.575; 37 -0.5,-7.575; 38 0,-7.575; 39 0.5,-7.575; 40 1,-7.575; 41 1.5,-7.575; 42 2,-7.575; 43 2.5,-7.575; 44 3,-7.575; 45 3.5,-7.575; 46 4,-7.575; 47 4.5,-7.575; 48 5,-7.575; 49 5.5,-7.575; 50 6,-7.575; 76 6,7.575; 77 5.5,7.575; 78 5,7.575; 79 4.5,7.575; 80 4,7.575; 81 3.5,7.575; 82 3,7.575; 83 2.5,7.575; 84 2,7.575; 85 1.5,7.575; 86 1,7.575; 87 0.5,7.575; 88 0,7.575; 89 -0.5,7.575; 90 -1,7.575; 91 -1.5,7.575; 92 -2,7.575; 93 -2.5,7.575; 94 -3,7.575; 95 -3.5,7.575; 96 -4,7.575; 97 -4.5,7.575; 98 -5,7.575; 99 -5.5,7.575; 100 -6,7.575
FC-135R = smd 1 x 1.8: P$1 -1.25,0; P$2 1.25,0
FA-238 = smd 0.9 x 0.8: P$1 -1.05,-0.75; P$2 1.05,-0.75; P$3 1.05,0.75; P$4 -1.05,0.75
1X20 = drill 1.016 pad 1.88 square: 1 0,0 | drill 1.016 pad 1.88: 2 2.54,0; 3 5.08,0; 4 7.62,0; 5 10.16,0; 6 12.7,0; 7 15.24,0; 8 17.78,0; 9 20.32,0; 10 22.86,0; 11 25.4,0; 12 27.94,0; 13 30.48,0; 14 33.02,0; 15 35.56,0; 16 38.1,0; 17 40.64,0; 18 43.18,0; 19 45.72,0; 20 48.26,0
BOARD_TEMPLATE = drill 2.9 pad 7.5: P$1 -39.5,39.5; P$2 -39.5,-39.5; P$3 39.5,-39.5; P$4 39.5,39.5
PC104_CONNECTOR = drill 0.953 pad 1.88 octagon: P$1 -31.75,31.88; P$2 -31.75,34.42; P$3 -31.75,36.96; P$4 -31.75,39.5; P$5 -29.21,31.88; P$6 -29.21,34.42; P$7 -29.21,36.96; P$8 -29.21,39.5; P$9 -26.67,31.88; P$10 -26.67,34.42; P$11 -26.67,36.96; P$12 -26.67,39.5; P$13 -24.13,31.88; P$14 -24.13,34.42; P$15 -24.13,36.96; P$16 -24.13,39.5; P$17 -21.59,31.88; P$18 -21.59,34.42; P$19 -21.59,36.96; P$20 -21.59,39.5; P$21 -19.05,31.88; P$22 -19.05,34.42; P$23 -19.05,36.96; P$24 -19.05,39.5; P$25 -16.51,31.88; P$26 -16.51,34.42; P$27 -16.51,36.96; P$28 -16.51,39.5; P$29 -13.97,31.88; P$30 -13.97,34.42; P$31 -13.97,36.96; P$32 -13.97,39.5; P$33 -11.43,31.88; P$34 -11.43,34.42; P$35 -11.43,36.96; P$36 -11.43,39.5; P$37 -8.89,31.88; P$38 -8.89,34.42; P$39 -8.89,36.96; P$40 -8.89,39.5; P$41 -6.35,31.88; P$42 -6.35,34.42; P$43 -6.35,36.96; P$44 -6.35,39.5; P$45 -3.81,31.88; P$46 -3.81,34.42; P$47 -3.81,36.96; P$48 -3.81,39.5; P$49 -1.27,31.88; P$50 -1.27,34.42; P$51 -1.27,36.96; P$52 -1.27,39.5; P$53 1.27,31.88; P$54 1.27,34.42; P$55 1.27,36.96; P$56 1.27,39.5; P$57 3.81,31.88; P$58 3.81,34.42; P$59 3.81,36.96; P$60 3.81,39.5; P$61 6.35,31.88; P$62 6.35,34.42; P$63 6.35,36.96; P$64 6.35,39.5; P$65 8.89,31.88; P$66 8.89,34.42; P$67 8.89,36.96; P$68 8.89,39.5; P$69 11.43,31.88; P$70 11.43,34.42; P$71 11.43,36.96; P$72 11.43,39.5; P$73 13.97,31.88; P$74 13.97,34.42; P$75 13.97,36.96; P$76 13.97,39.5; P$77 16.51,31.88; P$78 16.51,34.42; P$79 16.51,36.96; P$80 16.51,39.5; P$81 19.05,31.88; P$82 19.05,34.42; P$83 19.05,36.96; P$84 19.05,39.5; P$85 21.59,31.88; P$86 21.59,34.42; P$87 21.59,36.96; P$88 21.59,39.5; P$89 24.13,31.88; P$90 24.13,34.42; P$91 24.13,36.96; P$92 24.13,39.5; P$93 26.67,31.88; P$94 26.67,34.42; P$95 26.67,36.96; P$96 26.67,39.5; P$97 29.21,31.88; P$98 29.21,34.42; P$99 29.21,36.96; P$100 29.21,39.5; P$101 31.75,31.88; P$102 31.75,34.42; P$103 31.75,36.96; P$104 31.75,39.5
MSP-CAN_BLOCK = smd 1.2 x 0.8: 1 -6,6.08; 2 -6,7.88; 3 -8.5,6.08; 4 -8.5,7.88; 9 -8.5,-6.08; 10 -8.5,-7.88; 11 -6,-6.08; 12 -6,-7.88; 13 8.5,6.08; 14 8.5,7.88; 15 6,6.08; 16 6,7.88; 23 8.875,18.955; 24 8.875,20.755; 25 8.875,17.045; 26 8.875,15.245; 27 -3.375,25.205; 28 -3.375,27.005 | smd 1 x 0.25: 3.3V@CAN1 -3.375,25.125; 3.3V@CAN2 8.875,18.875; 3.3V@MSP1 8.501,5.884; 3.3V@MSP2 -8.533,-5.962; 3.3V_ANALOG@MSP2 -8.482,5.904 | smd 0.8 x 1.2: 5 -5.83,10.5; 6 -7.63,10.5; 7 -3.58,13; 8 -5.38,13; 17 -8.545,24.75; 18 -6.745,24.75; 19 -5.83,15.75; 20 -7.63,15.75; 21 7.83,24.5; 22 9.63,24.5 | smd 0.25 x 1: 5V 7.65,24.5 | smd 1.75 x 0.4: CANH -1.6,21.96; CANL -1.6,22.61; P$65 -1.6,23.91; P$66 -1.6,23.26; P$69 -1.6,21.31; P$70 -1.6,20.66; P$71 -1.6,20.01; P$72 -1.6,19.36; P$73 -1.6,18.71; P$74 -1.6,18.06; P$75 -1.6,17.41; P$76 -1.6,16.76; P$77 -1.6,16.11; P$78 -1.6,15.46; P$79 5.6,15.46; P$80 5.6,16.11; P$81 5.6,16.76; P$82 5.6,17.41; P$83 5.6,18.06; P$84 5.6,18.71; P$85 5.6,19.36; P$86 5.6,20.01; P$87 5.6,20.66; P$88 5.6,21.31; P$89 5.6,21.96; P$90 5.6,22.61; P$91 5.6,23.26; P$92 5.6,23.91 | drill 0.61: GND@1 -3.375,27.875; GND@2 -5.875,24.75; GND@3 -3.75,17.5; GND@4 0.5,20.75; GND@5 -8.5,15.75; GND@7 -8.5,10.5; GND@8 -7.25,8; GND@9 -4,7.5; GND@10 -1,7.5; GND@11 7.75,22.25; GND@12 10.5,24.5; GND@13 8.875,21.625; GND@14 7.25,8; GND@15 7.5,4.25; GND@16 -7.5,-4; GND@17 -7.25,-8; GND@26 -6.25,13; P2.4_SPI-CS2 5.397,10.16; P2.7_SPI-CS3 7.303,10.16; P5.4_SPI-MOSI 3.487,11.434; P5.5_SPI-MISO 1.9,12.354; P5.6_SPI-CLK 0,13.348 | smd 1.55 x 0.25: P1.0_A0 -5.6,3.75; P1.1_A1 -5.6,3.25; P1.2_A2 -5.6,2.75; P1.3_A3 -5.6,-1.75; P1.4_A4 -5.6,-2.25; P1.5_A5 -5.6,-2.75; P1.6_GPIO/PWM 5.6,-0.75; P1.7_GPIO/PWM 5.6,-0.25; P2.1_RXD 5.6,-3.75; P2.2_GPIO/PWM 5.6,-3.25; P3.0_A12 -5.6,2.25; P3.1_A13 -5.6,1.75; P3.2_A14 -5.6,1.25; P3.3_A15 -5.6,0.75; P3.4_GPIO_DEBUG 5.6,-2.75; P3.5_GPIO_DEBUG 5.6,-2.25; P3.6_GPIO/PWM 5.6,-1.75; P3.7_GPIO/PWM 5.6,-1.25; P5.0_I2C-SDA-1 5.6,0.25; P5.1_I2C-SCL-1 5.6,0.75; P7.0_I2C-SDA-2 -5.6,-0.25; P7.1_I2C-SCL-2 -5.6,-0.75; P$8 -5.6,0.25; P$11 -5.6,-1.25; P$15 -5.6,-3.25; P$16 -5.6,-3.75; P$43 5.6,1.25; P$44 5.6,1.75; P$45 5.6,2.25; P$46 5.6,2.75; P$47 5.6,3.25; P$48 5.6,3.75 | smd 0.25 x 1.55: P2.0_TXD 3.75,-5.6; P2.5_GPIO 1.75,-5.6; P2.6_GPIO/PWM 2.25,-5.6; P4.0_GPIO -0.25,-5.6; P4.1_GPIO 0.25,-5.6; P4.2_GPIO 0.75,-5.6; P4.3_GPIO 1.25,-5.6; P7.2_SYNC1 -1.75,-5.6; P7.3_GPIO -1.25,-5.6; P7.4_GPIO -0.75,-5.6; P$17 -3.75,-5.6; P$18 -3.25,-5.6; P$19 -2.75,-5.6; P$49 3.75,5.6; P$50 3.25,5.6; P$51 2.75,5.6; P$52 2.25,5.6; P$53 1.75,5.6; P$54 1.25,5.6; P$55 0.75,5.6; P$56 0.25,5.6; P$57 -0.25,5.6; P$58 -0.75,5.6; P$59 -1.25,5.6; P$60 -1.75,5.6; P$61 -2.25,5.6; P$62 -2.75,5.6; P$63 -3.25,5.6; P$64 -3.75,5.6; PJ.3_SYNC2 -2.25,-5.6; SBWTCK 2.75,-5.6; SBWTDIO 3.25,-5.6 | smd 1 x 1.8: P$93 -3.79,10.16; P$94 -1.29,10.16 | smd 1.25 x 1.6: P$104 -6.13,18.38; P$105 -6.13,22.08; P$106 -8.33,22.08; P$107 -8.33,18.38
CAN_BLOCK = smd 0.25 x 1: 3.3V@CAN1 -3.875,6.375; 5V 5.65,4.5 | smd 1 x 0.25: 3.3V@CAN2 6.875,-1.125; CLK -3.25,-4.6; CS 3.4,-3.2; INT -3.25,-3.85; MISO 3.25,-4.6; MOSI 3.25,-3.85 | smd 0.8 x 1.2: 17 -8.045,3.75; 18 -6.245,3.75; 19 -6.33,-5.5; 20 -8.13,-5.5; 21 5.83,4.5; 22 7.63,4.5; 27 -3.795,6.375; 28 -1.995,6.375 | smd 1.2 x 0.8: 23 6.875,-1.045; 24 6.875,0.755; 25 6.875,-2.955; 26 6.875,-4.755 | smd 1.75 x 0.4: CANH -3.6,1.96; CANL -3.6,2.61; P$65 -3.6,3.91; P$66 -3.6,3.26; P$69 -3.6,1.31; P$70 -3.6,0.66; P$71 -3.6,0.01; P$72 -3.6,-0.64; P$73 -3.6,-1.29; P$74 -3.6,-1.94; P$75 -3.6,-2.59; P$76 -3.6,-3.24; P$77 -3.6,-3.89; P$78 -3.6,-4.54; P$79 3.6,-4.54; P$80 3.6,-3.89; P$81 3.6,-3.24; P$82 3.6,-2.59; P$83 3.6,-1.94; P$84 3.6,-1.29; P$85 3.6,-0.64; P$86 3.6,0.01; P$87 3.6,0.66; P$88 3.6,1.31; P$89 3.6,1.96; P$90 3.6,2.61; P$91 3.6,3.26; P$92 3.6,3.91 | drill 0.61: GND@1 -1.125,6.375; GND@2 -6.25,4.75; GND@3 -1.5,-1.5; GND@4 -1.5,0.75; GND@5 -9,-5.5; GND@11 5.75,2.25; GND@12 8.5,4.5; GND@13 6.875,1.625 | smd 1.25 x 1.6: P$104 -6.13,-2.62; P$105 -6.13,1.08; P$106 -8.33,1.08; P$107 -8.33,-2.62
1X08_CONNECTOR = drill 1.016 pad 1.88: 2 2.54,-0.127; 3 5.08,0.127; 4 7.62,-0.127; 5 10.16,0.127; 6 12.7,-0.127; 7 15.24,0.127; 8 17.78,-0.127 | drill 1.016 pad 1.88 square: SBWTCK 0,0.127
HMC5983 = smd 0.45 x 0.3: !SPI_CS -1.275,-0.75; C1 1.275,-0.25; GND 1.275,0.25; NC@3 -1.275,-0.25; SCL/SPI_SCK -1.275,0.75; SETC 1.275,0.75; SOC 1.275,-0.75; VDD -1.275,0.25 | smd 0.3 x 0.45: DRDY -0.25,1.275; I2C/!SPI -0.25,-1.275; NC@1 0.25,1.275; NC@2 0.25,-1.275; SDA/SPI_SDI -0.75,1.275; SETP 0.75,-1.275; SPI_SDO -0.75,-1.275; VDDIO 0.75,1.275
LSM6DSM = smd 0.25 x 0.475: CS 0.5,0.912; GND@1 0,-0.912; GND@2 0.5,-0.912; SCL 0,0.912; SDA -0.5,0.912; VDDIO -0.5,-0.912 | smd 0.475 x 0.25: INT1 -1.163,-0.75; INT2 1.163,-0.25; OCS_AUX 1.163,0.25; SCX -1.163,-0.25; SDO/SA0 -1.163,0.75; SDO_AUX 1.163,0.75; SDX -1.163,0.25; VDD 1.163,-0.75

### Placement (x,y rotation side)
C1  20,55.5 90 top
C2  83.75,71.5 0 top
C3  10,46.5 180 top
C4  30.21,53.35 90 top
C5  10,44.5 180 top
C6  30.29,49.18 270 top
C7  10,42.5 180 top
C8  26,35.5 0 top
C9  25.5,32.5 270 top
C10  19,32.5 270 top
C11  23.5,58.5 0 top
C12  26,55.5 90 top
C13  67.32,71.59 180 top
C14  58.7,72.3 0 top
C15  60,88 0 top
C16  8.96,74.29 0 top
C17  72.55,14.64 180 top
C18  76.34,14.23 270 top
C19  66.5,33.5 90 top
C20  69,33.5 90 top
C21  73.97,6.7 270 top
C22  58.59,63.65 270 top
C23  55.95,56.32 270 top
C24  44.25,66.3 180 top
C25  47.67,62.26 270 top
C26  54.95,64.32 180 top
C27  58.76,36.78 0 top
C28  58.76,39.35 0 top
C33  41.5,10 270 top
C34  45.5,10 270 top
C35  38.72,29.99 0 top
C37  43.5,10 270 top
C38  35.16,29.9 180 top
C39  52.5,26 90 top
C40  55.5,25.5 0 top
C41  55.5,19 0 top
C42  29.5,23.5 90 top
C43  32.5,26 180 top
C50  32.5,20 180 top
D1  10.42,35.42 270 top
D2  53.73,11.07 0 top
JP1  50.05,41.92 90 top
JP2  37.38,42 90 top
JP3  52.59,41.92 90 top
JP4  39.92,42 90 top
JP5  74.94,24.14 90 top
JP6  72.4,26.68 270 top
JP7  47.51,41.92 90 top
JP8  44.97,44.46 270 top
JP9  42.43,44.46 270 top
JP10  77.48,26.68 270 top
R1  10.42,31.56 0 top
R2  57.76,11.09 90 top
R3  81.29,32.78 180 top
R5  8.98,76.91 180 top
R6  8.95,71.83 180 top
R7  81.29,35.32 180 top
R9  38.49,34.98 0 top
R10  38.49,36.98 0 top
SDO/SA1  40.67,63.06 180 top
U1  20.5,45 0 top
U2  43,20.5 90 top
U$1  22.25,32.5 180 top
U$2  23.5,55.5 270 top
U$3  5,27 90 top
U$4  55.5,22.25 270 top
U$5  45,45 0 top
U$6  45,45 0 top
U$7  75.05,44.28 0 top
U$8  20.5,67 0 top
U$9  32.5,23.5 0 top
U$10  21,20.5 90 top
U$11  60,5 180 top
U$12  2,27 90 top
U$13  60,2 180 top
U$14  87.66,38.45 90 top
U$15  73.75,10.72 90 top
U$17  44.66,62.74 0 top
U$18  55.95,60.32 90 top

### Tracks (layer width: path | path; a pad name or v marks a point on that pad's centre or on a via)
3.3V  (via drill 0.35, 0.6)  (7 unrouted)
  Top 0.203: U1.13 11.4,45 C5.1 C7.1 11,42.4 v11,41.4 | U1.87 21,53.5 20.6,54 C1.1 19.69,54.6 17.94,56.35 | U1.73 C6.1 C4.1 29.6,52.5 v28.5,52.5 | C8.1 24.86,35.64 24,36.5 U1.45 | U2.13 43,11.4 C37.1 C34.1 45.6,11 v46.6,11 | U2.87 34.5,21 34,20.6 C50.1 31.5,18.1 v31.5,18 | U2.73 38.06,29.42 37.79,29.69 C35.1 C38.1 35.91,29.58 v35.5,28.3 | C39.1 52.36,24.86 51.5,24 U2.45 | U$8.3.3V@CAN2 28.94,65.88 v29.12,65.69 | U$8.3.3V@CAN1 16.56,73.38 v15.91,74.03 | U$10.3.3V@CAN2 22.12,28.42 v22.41,28.71 | U$10.3.3V@CAN1 13.37,16.62 v13.07,16.32 | U$6.P$76 58.97,87.87 C15.1 | 55.95,57.32 C23.1 57.1,57.22 57.67,56.65 v57.67,50.56 57.67,48.78 57.67,36.72 | 55.95,57.32 55.95,57.73 | 55.95,57.73 55.7,57.98 v56.01,57.96 | v56.01,57.96 55.73,58.63 U$18.VDD | U$18.I2C/!SPI 58.16,60.07 58.19,60.04 58.19,58.77 57.5,58.09 56.31,58.09 55.95,57.73 | U$18.VDDIO 54.21,61.07 v53.62,61.01 | v56.01,57.96 55.7,57.57 55.95,57.32 | C28.1 C27.1 57.67,36.72 | R10.1 37.45,36.84 36.33,36.84 v36.33,35.82 36.33,35.06 | 36.33,35.06 36.41,34.98 R9.1 37.51,35.06 36.33,35.06 | 57.67,36.72 57.67,35.57 v50.56,35.57 | U$17.VDDIO 44.13,61.8 44.13,60.97 | 47.53,61.16 46.89,60.52 v45.75,60.52 45.3,60.97 40.65,60.97 | U$17.CS 45.17,63.74 45.22,64.65 | C24.1 49.54,66.3 49.79,66.05 v49.79,60.46
  Top 0.254: 45.16,66.26 45.16,64.65 45.22,64.65 v45.75,64.65 | v45.75,60.52 45.75,61.91 U$17.VDD | C25.2 47.53,61.16
  Route3 0.203: v53.62,61.01 53.64,58.29 53.69,58.24 55.65,58.26 v56.01,57.96
  Bottom 0.203: v29.12,65.69 29.12,65.49 28.91,65.29 | v15.91,74.03 15.5,74.03 15.3,74.23 | v22.41,28.71 22.62,28.71 22.82,28.91 | v13.07,16.32 12.46,16.32 | v36.33,35.82 36.59,36.08 44.71,36.08 44.97,35.82 44.97,35.57 | 44.97,35.57 44.97,30.49 | v50.56,35.57 44.97,35.57 | v49.79,60.46 49.79,59.95 49.79,59.19 | 49.79,59.19 49.79,50.56 v57.67,50.56 | 45.73,60.46 45.73,59.19 49.79,59.19
  Bottom 0.254: v45.75,60.52 v45.75,64.65
  other vias: 18,56.5 52.6,24.2 24.2,35.4
  pour Bottom: -0.24,91.23 62.5,95 62.5,75 31.16,75 31,31 63,31 63,-0.5 -2.25,-0.75
3.3V-ISO  (via drill 0.6)  (2 unrouted)
  Top 0.203: v68.34,72.81 68.34,71.7 C13.1 68.74,71.59 70.57,69.76 71.32,69.76 U$7.3.3V@CAN1 71.67,67.41 v71.38,67.12 | v85.2,63.26 84.03,63.26 U$7.3.3V@CAN2 | U$7.3.3V@MSP1 83.44,50.05 80.53,50.05 79.92,49.44 79.92,49.23 78.7,48.02 71.38,48.02 69.22,50.18 U$7.3.3V_ANALOG@MSP2 66.57,38.37 U$7.3.3V@MSP2 66.45,38.25 65.25,38.25 65.25,32.75 65.4,32.6 C19.1 C20.1 | C20.1 69.15,32.75 | 67,50 65,50 65,70 65.25,70.25 67,70.25 68,71.25 | U$15.VDD 73.57,9.38 73.47,9.27 73.47,8.95 73.87,8.54 v73.87,8.44 | U$15.VDDIO 72.45,11.49 71.94,11.49 v71.54,11.59 | v73.87,8.44 73.97,8.14 C21.1 72.87,7.6 | 73.76,7.72 72.87,7.6 | U$15.I2C/!SPI 76,10.47 76,8.97 75.47,8.44 74.5,8.44 | 74.5,8.44 v73.87,8.44 | U$15.!SPI_CS 74.5,8.44 | C20.1 69.08,32.52 v71.13,32.78 72.15,32.52 72.15,30.24 67.32,25.41 67.32,7.88 67.61,7.6 72.87,7.6 | R3.1 R7.1 82.31,35.2 v82.31,34.05
  Route3 0.203: U$6.P$84 U$6.P$83 64.05,81.77 65.31,80.5 65.31,74.2 66.3,73.21 67.93,73.21 v68.34,72.81 | v71.38,67.12 75.65,67.12 78.5,64.27 85,64.27 v85.2,63.26 | v71.54,11.59 71.54,8.54 72.96,8.54 73.06,8.44 v73.87,8.44
  Bottom 0.203: v82.31,34.05 80.27,32.01 72.65,32.01 72.15,32.52 v71.13,32.78
5V  (via drill 0.6)
  Top 0.203: v56,72 57.51,72 C14.1 | v25,72 25.65,72 U$8.5V | U$10.5V 14.85,26.15 14,27 14,29 15.25,30.25 v28.75,30.25
  Route3 0.203: U$6.P$74 U$6.P$73 | U$6.P$73 58.97,76.03 59,76 59,76.85 U$6.P$73 | U$6.P$73 58.97,74.97 v56,72
  Bottom 0.203: v56,72 35,72 33,70 31.25,70 | 31.25,70 28,70 26,72 v25,72 | v28.75,30.25 31.25,32.75 31.25,70
5V-ISO
  Top 0.203: U$6.P$82 U$6.P$81 64.05,75.05 64,75 79.35,75 C2.1 82.7,71.35 U$7.5V
BCLUART_RXD1  (1 unrouted)
  Top 0.203: U1.6 7.67,48.5 6.82,47.75 6.61,47.33 6.61,46.23 5.82,45.52 U$3.8
  Route3 0.406: U$3.8 U$12.8 | U$12.8 1.7,44.78 1.48,44.56 1.78,44.56 U$12.8
BCLUART_RXD2
  Top 0.203: U2.6 39.5,7.72 U$11.8
  Top 0.406: U$11.8 U$13.8
BCLUART_TXD1
  Top 0.203: U$3.7 7.22,45.38 7.22,47.35 7.98,48 U1.7
  Route3 0.406: U$3.7 U$12.7
BCLUART_TXD2
  Top 0.203: U2.7 40,7.87 41.31,6.56 43.34,6.56 44.77,5.14 44.82,4.73 U$11.7
  Top 0.406: 44.82,4.73 44.82,2.06 U$13.7
CAN-INT1  (via drill 0.6)  (1 unrouted)
  Top 0.203: v11,50 11.5,49.5 U1.4 | v11,56 15.5,60.5 15.5,63 17.1,63
  Top 0.406: U$3.15 U$12.15
  Route3 0.203: v11,50 v11,56 10.5,56 7.8,58.7 7.78,59.11 U$3.15
CAN-INT2  (via drill 0.6)
  Top 0.203: 38.5,11.5 v38,11 | v32,11 27.5,15.5 25,15.5 25,17.1 U$10.INT
  Route3 0.203: v38,11 v32,11 32,10.5 29.3,7.8 29.3,7.78 26.37,6.56 U$11.15
  Route3 0.406: U$11.15 U$13.15
CANH  (via drill 0.6)
  Top 0.203: U$7.CANH 75.38,66.24 76.06,66.91 76.06,71.38 73.01,74.43 50.07,74.43 50.07,77.89 49.84,78.17 47.48,78.17 U$6.P$53 | U$10.CANH 19.06,16.92 19.06,19.06 11.03,27.09 v10.42,27.09 | v10.63,71.79 10.58,71.83 R6.1 | v31.35,73.01 30.54,73.82 24.24,73.82 19.36,68.95 16.91,68.95 U$8.CANH 20.96,68.96 v21,69
  Route3 0.203: v35.42,73.01 42.4,73.01 U$6.P$53 | v21,69 18.25,69.1 13.75,73.6 12.34,73.5 v10.63,71.79
  Bottom 0.203: v10.42,27.09 7.38,30.13 7.38,52.69 9.81,55.13 9.81,70.37 10.63,71.18 v10.63,71.79 | v31.35,73.01 v35.42,73.01
CANL  (via drill 0.6)
  Top 0.203: U$7.CANL 75.02,66.89 75.25,67.12 75.25,71.18 72.6,73.82 48.82,73.82 | 48.82,73.82 U$6.P$57 | U$10.CANL 18.35,16.94 18.35,18.96 11.44,25.87 9.41,25.87 8.59,26.68 v8.59,26.88 | v10.83,76.87 10.79,76.91 R5.1 | 48.82,73.82 33.79,73.82 33.18,74.43 23.63,74.43 18.75,69.56 16.95,69.56 U$8.CANL 18.61,69.61 v19.5,70.5
  Route3 0.203: v19.5,70.5 17.5,70.5 14,74 13.7,74 v10.83,76.87
  Bottom 0.203: v8.59,26.88 6.97,28.51 6.97,52.89 9.41,55.33 9.41,69.35 9,69.76 9,76.87 v10.83,76.87
GND  (via drill 0.35, 0.6)  (1 unrouted)
  Top 0.203: C11.2 v25.5,58.5 | C9.2 v26.5,31.5 | C10.2 v18,31.5 | C3.2 v8.2,46.5 | C5.2 v8.2,44.5 | C7.2 v8.2,42.5 | U1.15 14.25,44 14.25,45 v14.75,45 | C1.2 v20,57.5 | U1.82 23.5,51 | 23.5,51 | 23.5,51 v24,51 | U1.84 22.5,51 v22,51 | U1.72 v26.5,49.5 | C6.2 v30.34,47.41 | C4.2 v30.2,55.13 | U1.40 v21.5,39 | U1.43 v23,39 | C8.2 27.76,35.44 v28,35.5 | C12.2 26,57 v26.5,57.5 | C42.2 v29.5,25.5 | C40.2 v56.5,26.5 | C41.2 v56.5,18 | C33.2 v41.5,8.2 | C37.2 v43.5,8.2 | C34.2 v45.5,8.2 | U2.15 43.95,14.08 43.59,14.44 v43.59,14.5 | C50.2 v30.5,20 | U2.82 37,23.5 | 37,23.5 | 37,23.5 v37,24 | U2.84 37,22.5 v37,22 | U2.72 v38.5,26.5 | C35.2 v40.56,30 | C38.2 v33.48,29.79 | U2.40 v49,21.5 | U2.43 v49,23 | C39.2 52.56,27.76 v52.5,28 | C43.2 31,26 v30.5,26.5 | R1.2 v12.25,31.56 | R2.2 57.76,12.86 v57.77,13.07 | C16.2 10,74.43 v10.83,74.43 | U$6.P$80 61.51,87.39 C15.2 | C14.2 60.7,72.3 v61,72.25 | U$18.GND 55.7,62.57 v55.38,62.84 | U$18.SOC 56.7,62.34 v57.05,62.86 | C23.2 55.89,55.35 v55.89,54.37 | C27.2 59.7,36.74 59.7,36.33 59.66,36.37 C27.2 | C27.2 C28.2 | C27.2 59.7,36.81 v59.7,37.86
  Top 0.254: U$17.SDX U$17.SCX 44.5,62.5 | 44.5,62.5 44.66,62.34 U$17.GND@1 U$17.GND@2 | 44.5,62.5 v44.55,62.55 | v42.34,66.01 43.01,66.01 C24.2 42.95,66.65 v42.34,66.65 | v47.38,64.12 47.38,63.5 47.57,63.3 | 47.57,63.3 C25.1 | v48.02,64.12 48.02,63.75 47.57,63.3 | v40.36,65.67 40.67,65.33 40.67,65.3 | v40.99,65.67 40.67,65.3 | 40.67,65.3 SDO/SA1.P$1
  GND 0.203: v10.83,74.43 11.24,74.03 | v55.89,54.37 55.64,54.11 55.64,53.6 | v59.7,37.86 59.95,38.11 60.72,38.11
  Bottom 0.203: v8.2,42.5 7.91,42.5 | v14.75,45 14.89,44.75 | v20,57.5 20,58 | v24,51 24.09,51 | v22,51 21.7,51 | v26.5,49.5 26.41,49.5 | v30.34,47.41 30.79,48.05 | v30.2,55.13 30.5,54.72 | v21.5,39 21.5,39.5 | v23,39 23,39.5 23.5,39 | v28,35.5 28.25,35.5 | v26.5,57.5 27,57.5 | v45.5,8.2 45.5,7.5 | v43.59,14.5 43.75,14.49 | v30.5,20 30,20 | v37,24 37,24.09 | v37,22 37,21.7 | v38.5,26.5 38.5,26.41 | v40.56,30 40.77,30.18 | v33.48,29.79 33.16,29.75 | v49,21.5 48.5,21.5 | v49,23 48.5,23 49,23.5 | v52.5,28 53,28 | v30.5,26.5 30.7,26.19 | v12.25,31.56 12.66,31.56 | v57.77,13.07 57.77,13.47 | v61,72.25 61,73 | v55.38,62.84 54.95,63.32 | v57.05,62.86 57.1,63.24 57.25,63.39
  Bottom 0.254: v44.55,62.55 44.5,62.5
  pour GND: -3.5,94.18 62.3,92.56 62.5,71 34.16,71 34,33 63,33 63,-0.5 -2.25,-0.75
  pour GND: 43,33 43,34 36,34 36,69 62,69 61.99,62.14 54.11,62.24 54.11,58.43 61.99,58.43 62,34 47,34 47,33
  pour GND (no thermals): 61.99,58.18 61.99,62.24 57.92,62.24 57.92,58.18
GND-ISO  (via drill 0.6)
  Top 0.203: C2.2 85.72,71.5 v85.81,71.59 | C13.2 v65.49,71.59 | U$15.GND 73.47,12.03 73.47,12.61 73.16,12.91 v73.16,13.22 | U$15.SOC 74.79,12.49 v74.79,13.22 | C17.2 v70.72,14.64 | C21.2 73.97,5.38 v73.97,4.99 | C19.2 C20.2 69,34.5 v67.75,34.75
  GND 0.203: v85.81,71.59 86.62,71.59 | v65.49,71.59 65.09,71.59 | v74.79,13.22 74.89,13.62 | v73.16,13.22 73.36,13.22 | v70.72,14.64 70.01,15.81 | v73.97,4.99 75.85,4.84 | 68,34.75 v67.75,34.75
  pour GND: 64,90 90,90 90,31.75 64,31.75
  pour GND (rank 2): 65.03,1.16 88.75,1.16 89,31 75.5,31 75.5,34 71.5,34 71.5,31 65,31 65.03,12.71 75.7,12.71 75.7,8.9 65.03,8.9
  pour GND (no thermals): 65.03,13.47 71.89,13.47 71.89,8.39 65.03,8.39
I2C_SCL1  (via drill 0.6)  (1 unrouted)
  Top 0.203: 25,50.3 24.7,49.69 24.66,49.96 24.77,49.96 v24.57,49.56
  Route3 0.203: v24.57,49.56 20,45.4 20,37.25 11.86,37.16 4.08,37.16 U$3.5
  Route3 0.406: 4.08,37.16 U$12.5
I2C_SCL2  (via drill 0.6)  (4 unrouted)
  Top 0.203: U2.79 37.7,25 37.7,24.59 | 37.7,24.59 38.04,24.26 38.04,24.05 v38.85,23.65 | 37.7,24.59 37.7,24.55 38.62,23.63 v42.17,23.63
  Top 0.254: U$17.SCL 44.66,64.16 44.03,64.79 42.7,64.79 42.19,64.28 39.65,64.28 38.57,63.2 38.57,47.36 37.58,46.37 37.58,44.74 JP2.2
  Top 0.406: U$11.5 U$13.5
  Route3 0.203: v38.85,23.65 49.82,12.88 49.82,5.1 | v42.17,23.63 42.94,23.63 43.7,24.39 43.7,35.82 | 43.7,35.82 42.43,37.09 39.5,37.09 R10.2 39.39,37.84 38.36,38.87 38.36,41.02 JP2.1 | 43.7,35.82 45.94,35.82 JP3.1
  other vias: 39.79,37.07
I2C_SDA1  (via drill 0.6)  (1 unrouted)
  Top 0.203: 24.65,47.61 v24.56,47.52 | 25.5,48.46 24.65,47.61 | 24.65,47.61 24.65,47.41
  Route3 0.203: v24.56,47.52 23.94,47.52 22.92,47.51 20.5,45.25 20.5,36.52 7.44,36.52 4.02,34.52 U$3.4
  Route3 0.406: 4.02,34.52 2.1,34.52 U$12.4
I2C_SDA2  (via drill 0.6)  (3 unrouted)
  Top 0.203: U2.78 38.42,25.5 | 38.42,25.5 v38.85,25.07 | 38.42,25.5 42.08,25.5 v42.17,25.41 | v41.41,35.06 41.16,35.06 | R9.2 39.47,35.06 41.16,35.06 | 41.16,35.06 41.16,40.76 JP4.1 | v47.76,35.06 50.05,37.35 JP1.1 50.05,42.22 | U$18.SDA/SPI_SDI 50.08,54.97 JP1.2
  Top 0.254: U$17.SDA 44.16,64.02 43.84,64.34 42.89,64.34 42.3,63.75 39.76,63.75 39.03,63.01 39.03,45.43 JP4.2
  Top 0.406: U$11.4 U$13.4
  Route3 0.203: v38.85,25.07 52.26,11.25 52.26,4.83 | v42.17,25.41 42.17,25.66 42.94,26.43 42.94,35.06 | 42.94,35.06 v41.41,35.06 | 42.94,35.06 v47.76,35.06
IMU_INT1
  Top 0.203: U$17.INT1 39.89,61.99 39.63,61.73 39.63,47.25 JP9.1
IMU_INT2
  Top 0.203: 48.05,59.82 46.86,59.82 44.97,57.92 JP8.1
  Top 0.254: U$17.INT2 45.87,62.53 46.2,62.53 46.59,62.93 46.59,64.55 46.87,64.83 48.53,64.83 48.75,64.61 48.75,60.52 48.05,59.82
N$1
  Top 0.203: U2.16 44.5,14.02 45.17,14.69 48.83,14.69 51.06,12.46 51.06,12.24 D2.A
N$2
  Top 0.203: D2.C 56.89,11.07 R2.1
N$3
  Top 0.203: U1.16 14.13,43.5 14.49,43.14 14.49,39.08 13.27,37.86 11.36,37.86 D1.A
N$4
  Top 0.203: R1.1 9.52,33.02 D1.C
N$5
  Top 0.203: U$7.P3.5_GPIO_DEBUG 81.65,42.03 82.36,42.73 82.36,46.39 84.8,48.83 84.8,53.24 U$14.8
N$6
  Top 0.203: U$7.P3.4_GPIO_DEBUG 81.76,41.53 82.76,42.53 82.76,46.19 85.2,48.63 85.2,51.36 U$14.7
N$7
  Top 0.203: U1.12 11.9,45.5 C3.1
N$8
  Top 0.203: U1.41 22,35 21,34 U$1.P$2 20,33.5 19.1,33.5 C10.1 | U1.41
N$9
  Top 0.203: U1.42 22.5,35 23.5,34 U$1.P$1 24.5,33.5 25.4,33.5 C9.1
N$10
  Top 0.203: U1.85 21.93,53.56 21.93,55.47 24.25,55.45 U$2.P$3 24.4,54.3 C12.1
N$11
  Top 0.203: U1.86 21.49,52.78 21.49,55.81 22.63,56.55 U$2.P$1 22.75,58.35 C11.1
N$12
  Top 0.203: U$7.P2.1_RXD 82.24,40.53 U$14.4
N$13
  Top 0.203: U$7.P2.0_TXD 82.68,38.68 U$14.3
N$14
  Top 0.203: U$7.SBWTDIO 78.3,37.65 78.5,37.45 82.76,37.45 85.81,40.5 87.29,40.5 U$14.2
N$15
  Top 0.203: U$7.SBWTCK 77.8,37.54 78.29,37.04 86.12,37.04 U$14.SBWTCK
N$16
  Top 0.203: 71.72,9.22 U$15.SDA/SPI_SDI 71.65,9.15 70.11,9.15 68.59,10.68 68.59,15.76 74.95,21.86 JP5.1
N$17
  Top 0.203: R6.2 8.06,71.85 C16.1 8.08,74.31 R5.2
N$18
  Top 0.203: 72.96,9.41 U$15.SCL/SPI_SCK 72.19,8.65 69.86,8.65 68.08,10.42 68.08,16.01 72.3,20.23 JP6.2
N$19
  Top 0.203: U$15.C1 73.97,12.02 73.97,13.83 73.45,14.52 C17.1
N$20
  Top 0.203: U$15.SETP 76.34,12.79 C18.2
N$21
  Top 0.203: U$15.SETC 72.25,12.74 72.25,13.52 72.55,13.83 72.55,15.55 72.65,15.66 75.8,15.66 76.54,14.92 C18.1
N$22
  Top 0.203: U$15.DRDY arc-90 72.42,10.42 70.37,10.42 69.1,11.69 69.1,15.25 77.23,23.12 JP10.2
N$25
  Top 0.254: SDO/SA1.P$2 42.57,63.06 43,63.49 U$17.SDO/SA0
N$26
  Top 0.203: U$18.SCL/SPI_SCK 52.62,56.46 JP3.2
N$27  (via drill 0.6)
  Top 0.203: JP6.1 72.91,27.19 v72.91,34.55 79.63,34.55 R7.2 | v74.43,43.7 75.76,45.03 U$7.P5.1_I2C-SCL-1
  Route3 0.203: v72.91,34.55 74.43,36.08 v74.43,43.7
N$28  (via drill 0.6)
  Top 0.203: JP5.2 74.69,26.93 74.94,26.93 73.92,27.95 v73.92,33.03 80.14,33.03 R3.2 | v75.45,41.67 78.31,44.53 U$7.P5.0_I2C-SDA-1
  Route3 0.203: v73.92,33.03 75.45,34.55 v75.45,41.67
N$29
  Top 0.203: U2.62 43.5,40.96 JP8.2
N$30
  Top 0.203: U2.61 44,40.19 44.21,40.4 45.48,40.4 JP7.1
N$31  (via drill 0.6)
  Top 0.203: v77.48,40.9 78.5,41.92 78.5,43.44 79.08,44.03 U$7.P1.7_GPIO/PWM
  Route3 0.203: JP10.1 75.19,28.97 75.19,31.76 76.72,33.28 76.72,40.14 v77.48,40.9
N$32
  Top 0.203: U2.63 43,41.35 JP9.2
N$34
  Top 0.203: U$18.C1 56.2,64.32 C26.1
N$35
  Top 0.203: U$18.SETP 57.59,61.07 58.55,62.02 58.55,62.7 C22.2
N$36  (1 unrouted)
  Top 0.203: U$18.SETC 55.2,61.68 54.43,62.45 54.43,63.09 54.94,63.6 54.94,65.4 54.99,65.45 58.04,65.45 58.72,64.77
N$38
  Top 0.203: U$18.DRDY 54.64,60.03 54.14,60.03 47.51,53.4 JP7.2
N$40
  Top 0.203: U2.42 53,22.5 54,23.5 U$4.P$1 54.5,24.5 54.5,25.4 C40.1
N$41
  Top 0.203: U2.41 53,22 54,21 U$4.P$2 54.5,20 54.5,19.1 C41.1 | U2.41
N$42
  Top 0.203: U2.86 35.22,21.49 32.19,21.49 31.45,22.63 U$9.P$1 29.65,22.75 C42.1
N$43
  Top 0.203: U2.85 35.09,21.98 32.53,21.98 32.55,24.25 U$9.P$3 33.7,24.4 C43.1
RST1  (1 unrouted)
  Top 0.203: 23.02,52.76 23.02,50.52 22.18,49.93 20.92,49.93 19.95,50.9 14.66,50.9 13.65,51.92 10.23,51.92 9.62,51.31 9.62,49.48 9.21,49.07 7.43,49.07 6.41,48.31 5.16,47.12 4.12,47.12 U$3.9
  Top 0.406: 4.12,47.12 2.2,47.12 U$12.9
RST2  (1 unrouted)
  Top 0.203: U2.83 35.24,23.02 37.48,23.02 38.32,22.18 38.32,21.17 37.1,19.95 37.1,14.66 36.08,13.65 36.08,10.23 36.69,9.62 38.52,9.62 38.93,9.21 38.93,7.43 39.94,6.41 39.66,5.36 39.66,4.33
  Top 0.406: U$11.9 U$13.9
SPI-CLK1  (via drill 0.6)
  Top 0.203: v16.13,49.76 16.13,48.13 14.99,47 U1.9 | v14.71,57.69 17.25,60.26 U$8.CLK
  Route3 0.203: v16.13,49.76 16.13,56.87 v14.71,57.69 14.1,58.29 10.64,58.29 7.19,61.75 7.19,65.41 4.81,67.58 U$3.17
  Route3 0.406: 4.81,67.58 2.47,67.38 U$12.17
SPI-CLK2  (via drill 0.6)  (1 unrouted)
  Top 0.203: U2.9 41,14.99 39.87,16.13 v38.24,16.13 | v30.32,14.71 27.74,17.25 U$10.CLK
  Route3 0.203: v38.24,16.13 31.13,16.13 v30.32,14.71 29.71,14.1 29.71,10.64 25.64,7.39 20.77,7.39 19.41,4.81
  Route3 0.406: 19.41,4.81 19.41,2.05 U$13.17
SPI-CS1  (via drill 0.6)  (1 unrouted)
  Top 0.203: v14.71,49.76 14.71,47.52 14.68,47.5 U1.8 | v14.71,55.86 22.63,63.78 23.88,63.78
  Top 0.406: U$3.16 U$12.16
  Route3 0.203: v14.71,49.76 v14.71,55.86 13.28,55.86 11.46,57.69 10.24,57.69 6.58,61.65 6.58,63.25 U$3.16
SPI-CS2  (via drill 0.6)  (1 unrouted)
  Top 0.203: U2.8 40.5,14.68 40.48,14.71 v38.24,14.71 | v32.14,14.71 24.22,22.63 24.22,23.88
  Route3 0.203: v38.24,14.71 v32.14,14.71 32.14,13.28 30.32,11.46 30.32,10.24 25.84,6.78 22.02,6.78 U$11.16
  Route3 0.406: U$11.16 U$13.16
SPI-MISO1  (via drill 0.6)
  Top 0.203: v19.18,49.76 19.18,48.74 16.43,46 U1.11 | v20.8,59.51 20.86,59.51 U$8.MISO
  Route3 0.203: v19.18,49.76 19.18,58.5 20.19,59.51 v20.8,59.51 20.4,59.92 11.05,59.92 9.02,61.95 9.02,68.05 4.61,72.86 U$3.19
  Route3 0.406: 4.61,72.86 2.14,72.86 U$12.19
SPI-MISO2  (via drill 0.6)  (1 unrouted)
  Top 0.203: U2.11 42,16.43 39.26,19.18 v38.24,19.18 | v28.49,20.8 28.49,20.86 U$10.MISO
  Route3 0.203: v38.24,19.18 29.5,19.18 28.49,20.19 v28.49,20.8 28.08,20.4 28.08,11.05 25.23,9.02 19.14,9.22 14.33,5.02
  Route3 0.406: 14.33,5.02 14.33,2.05 U$13.19
SPI-MOSI1  (via drill 0.6)  (1 unrouted)
  Top 0.203: v17.75,49.76 17.75,48.74 15.51,46.5 U1.10 | v18.36,57.89 18.36,58.6 22.84,63.17 23.73,63.17
  Route3 0.203: v17.75,49.76 17.75,50.57 16.94,51.39 16.94,57.28 17.15,57.48 | 17.15,57.48 17.75,57.48 | 17.75,57.48 v18.36,57.89 17.96,57.48 17.75,57.48 | U$3.18 4.12,70.61 8,66.73 8,61.75 10.85,58.9 15.72,58.9 17.15,57.48
  Route3 0.406: 4.12,70.61 2.43,70.61 U$12.18
SPI-MOSI2  (via drill 0.6)  (2 unrouted)
  Top 0.203: U2.10 41.5,15.51 39.26,17.75 v38.24,17.75 | v30.11,18.36 29.4,18.36 24.83,22.84 24.83,23.73
  Route3 0.203: v38.24,17.75 37.43,17.75 36.61,16.94 30.72,16.94 30.52,17.15 | 30.52,17.15 30.52,17.75 | 30.52,17.75 v30.11,18.36 30.52,17.96 30.52,17.75 | 16.88,4.93 19.75,8 25.44,8 29.1,10.85 29.1,15.72 30.52,17.15
  Route3 0.406: U$11.18 U$13.18
SYNC1  (via drill 0.6)
  Top 0.203: U$7.P7.2_SYNC1 73.31,38.69 73.31,45.07 74.53,46.29 v74.53,46.8 | U2.64 42.5,30.98 41.78,31.7 35.89,31.7 31.35,31.73 31.35,45.07 31.96,45.07 | 31.96,45.07 31.96,70.16 33.18,70.16 v33.18,72.81 | U1.64 29.2,45.5 v29.93,44.77 | v32.37,44.77 32.37,45.17 31.96,45.07
  Route3 0.203: v29.93,44.77 v32.37,44.77 | v33.18,72.81 33.18,75.35 40.17,75.33 41.19,76.34 U$6.P$45
  Bottom 0.203: v74.53,46.8 75.65,47.91 75.65,54.11 73.21,56.55 73.21,74.23 46.59,74.23 44.99,75.85 44.99,77.68 44.56,78.14 42.53,78.14 41.32,76.88 U$6.P$45
SYNC2  (via drill 0.6)
  Top 0.203: U$7.PJ.3_SYNC2 v72.81,46.8 | U2.65 42,30.87 41.58,31.29 33.68,31.29 30.95,31.28 30.95,45.98 | 30.95,45.98 28.09,45.98 U1.65 | 30.95,45.98 31.56,45.98 v31.56,71.38
  Route3 0.203: v31.56,71.38 31.76,71.59 34.2,71.59 34.2,74.84 42.73,74.84 43.73,75.84 U$6.P$49
  Bottom 0.203: v72.81,46.8 75.25,49.23 75.25,53.91 72.81,56.35 72.81,73.82 46.39,73.82 43.73,76.48 U$6.P$49
TCK_SWDCLK1
  Top 0.203: U$3.10 4.22,49.56 4.95,49.56 7.22,51.83 7.22,53.34 7.63,53.75 16.7,53.75 17,53.44 U1.95
  Top 0.406: 4.22,49.56 2.3,49.56 U$12.10
TCK_SWDCLK2  (1 unrouted)
  Top 0.203: U2.95 34.56,17 34.25,16.7 34.25,7.63 34.66,7.22 36.17,7.22 37.22,5.56 37.22,4.83
  Top 0.406: 37.22,4.83 37.22,1.71 37.45,1.48 37.45,1.69 U$13.10
TDI1
  Top 0.203: U$3.13 4.33,57.08 5.36,57.08 7.23,55.2 7.23,55.17 7.44,54.97 17.31,54.97 18.5,53.77 U1.92
  Top 0.406: 4.33,57.08 2.41,57.08 U$12.13
TDI2  (1 unrouted)
  Top 0.203: U2.92 34.23,18.5 33.03,17.31 33.03,7.44 32.83,7.23 31.38,7.03 29.5,5.16 29.5,4.33
  Top 0.406: 29.5,4.33 29.5,2.02 U$13.13
  Route3 0.406: U$11.13 29.52,2.71 29.93,2.3
TDO1
  Top 0.203: U$3.12 4.3,54.56 17.1,54.56 18,53.66 U1.93
  Top 0.406: 4.3,54.56 2.38,54.56 U$12.12
TDO2  (1 unrouted)
  Top 0.203: U2.93 34.34,18 33.44,17.1 33.44,6.33 32.02,4.91
  Top 0.406: U$11.12 U$13.12
TMS_SWDIO1
  Top 0.203: U$3.11 4.26,52.06 5.19,52.06 6.82,53.54 7.43,54.15 16.9,54.15 17.5,53.55 U1.94
  Top 0.406: 4.26,52.06 2.34,52.06 U$12.11
TMS_SWDIO2  (1 unrouted)
  Top 0.203: U2.94 34.45,17.5 33.85,16.9 33.85,7.43 34.46,6.82 34.72,5.8 34.72,4.87
  Top 0.406: U$11.11 U$13.11
UART_RXD1
  Top 0.203: U1.34 18.5,36.38 17.74,35.62 8.59,35.62 6.97,33.99 6.97,31.49 U$3.2
  Top 0.406: U$3.2 U$12.2
UART_RXD2
  Top 0.203: U2.34 52.13,18.5 53.5,17.13 53.5,8.39 55.74,6.16 56.3,6.16 U$11.2
  Top 0.406: U$13.2 U$11.2
UART_TXD1
  Top 0.203: U$3.1 4.81,27.16 7.48,29.73 7.48,33.79 8.8,35.11 17.94,35.11 18.96,36.23 18.96,37.38 U1.35
  Top 0.406: 4.81,27.16 2.16,27.16 U$12.1
UART_TXD2
  Top 0.203: U2.35 52.24,19 53.91,17.33 53.91,8.59 55.94,6.56 58.44,6.56 U$11.1
  Top 0.406: U$13.1 60,4.12 60.41,4.53 60.41,4.59 U$11.1
VCORE
  Top 0.203: U2.12 42.5,11.9 C33.1

### Text on the board
tDocu: LSM6DSM
tSilk: SCL | SDA | INT1 | INT2 | DRDY | SDA | SCL | IMU | mag. | SCL | SDA | DRDY